# Altium project IV_Array.PrjPcb (part 1 of 2)
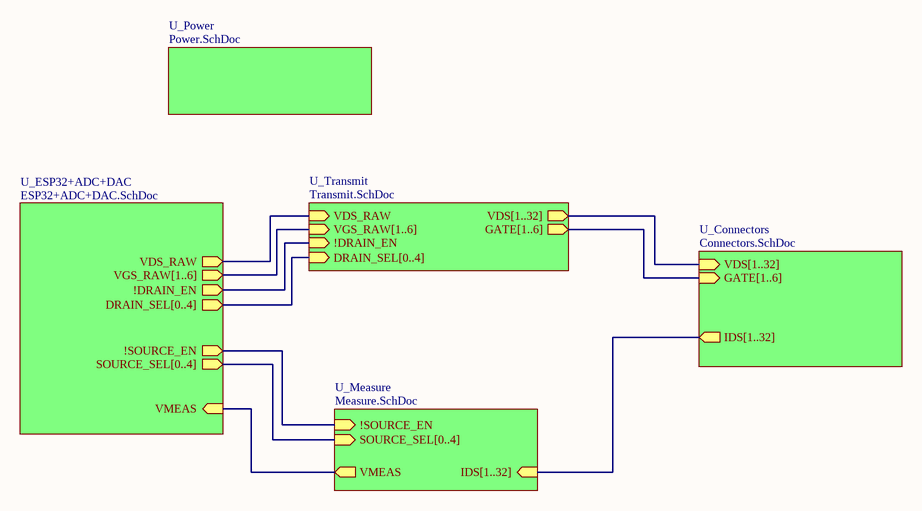
[diagram p0: Top_Level.SchDoc]
CAGE_CODE: ?????; CONTRACT_NUMBER: <CONTRACT NO>; DOC_NO_ASSY_DWG: <ASSY DWG NO>; DOC_NO_BOM: <BOM DOC NO>; DOC_NO_FAB_DWG: <FAB DWG NO>; DOC_NO_SCH_DWG: <SCH DWG NO>; PCB_2_DEC_TOL: +/-.01; PCB_3_DEC_TOL: +/-.010; PCB_ANG_TOL: +/-1/2; PCB_ASSEMBLY_NO: <PCB ASSY NO>; PCB_CHECKER: - -----; PCB_CHECKER_APP_DATE: --/--/----; PCB_DESIGNER: - -----; PCB_DESIGNER_APP_DATE: --/--/----; PCB_DWG_NO: <PCB DWG NO>; PCB_ENGINEER: - -----; PCB_ENGINEER_APP_DATE: --/--/----; PCB_PART_NUMBER: <PCB PN>; PCB_REV: A; SCH_REV: A
5 sheets, 117 parts. Net scope: hierarchical (ports join the sheet entries above them; power ports are global).
Board file: PCB1.PcbDoc
Sheets:
  Top_Level.SchDoc
    U_Connectors = Connectors.SchDoc
    U_ESP32+ADC+DAC = ESP32+ADC+DAC.SchDoc
    U_Transmit = Transmit.SchDoc
    U_Power = Power.SchDoc

## Sheet Top_Level.SchDoc
size 431 x 279 mm; SheetNumber: 1; SheetTotal: 5

### Sub-sheets
U_Connectors = Connectors.SchDoc: GATE[1..6] (in), VDS[1..32] (in), IDS[1..32] (out)
U_ESP32+ADC+DAC = ESP32+ADC+DAC.SchDoc: VDS_RAW (out), VGS_RAW[1..6] (out), !SOURCE_EN (out), !DRAIN_EN (out), DRAIN_SEL[0..4] (out), SOURCE_SEL[0..4] (out), VMEAS (in)
U_Measure = Measure.SchDoc (file not in this document): IDS[1..32] (in), !SOURCE_EN (in), SOURCE_SEL[0..4] (in), VMEAS (out)
U_Power = Power.SchDoc: no entries
U_Transmit = Transmit.SchDoc: VDS_RAW (in), !DRAIN_EN (in), DRAIN_SEL[0..4] (in), VDS[1..32] (out), GATE[1..6] (out), VGS_RAW[1..6] (in)

### Nets
!DRAIN_EN: sheet U_ESP32+ADC+DAC/!DRAIN_EN, sheet U_Transmit/!DRAIN_EN
!SOURCE_EN: sheet U_Measure/!SOURCE_EN, sheet U_ESP32+ADC+DAC/!SOURCE_EN
VDS_RAW: sheet U_ESP32+ADC+DAC/VDS_RAW, sheet U_Transmit/VDS_RAW
VMEAS: sheet U_Measure/VMEAS, sheet U_ESP32+ADC+DAC/VMEAS

### Buses and harness runs
bus sheet U_Connectors/GATE[1..6] = sheet U_Transmit/GATE[1..6]
bus sheet U_Connectors/IDS[1..32] = sheet U_Measure/IDS[1..32]
bus sheet U_Connectors/VDS[1..32] = sheet U_Transmit/VDS[1..32]
bus sheet U_ESP32+ADC+DAC/DRAIN_SEL[0..4] = sheet U_Transmit/DRAIN_SEL[0..4]
bus sheet U_ESP32+ADC+DAC/SOURCE_SEL[0..4] = sheet U_Measure/SOURCE_SEL[0..4]
bus sheet U_ESP32+ADC+DAC/VGS_RAW[1..6] = sheet U_Transmit/VGS_RAW[1..6]

### Notes on the sheet
- DWG. NO.
- REV.
- SHT.
- THIS DOCUMENT AND THE DATA DISCLOSED HEREIN OR HEREWITH IS THE PROPERTY OF ALTIUM LIMITED AND MAY BE FREELY DISTRIBUTED IN WHOLE. NO RIGHTS ARE RESERVED OR EXPRESS OR IMPLIED WARANTEE GIVEN.
- REVISION
- DESCRIPTION
- DATE
- APPROVED
- ENG:
- APPROVALS
- PROJECT
- DSN:
- CHK:
- REFERENCE DOCUMENTS
- PROJECT REVISION:
- TITLE
- DOCUMENT REVISION:
- DESIGN ITEM:
- BOM:
- FAB DWG:
- PCB DWG:
- ASSY DWG:
- SCALE:
- SIZE
- B
- CAGE CODE
- FILE NAME
- DWG NO.
- SHEET
- OF
- REV

## Sheet Connectors.SchDoc
size 431 x 279 mm; SheetNumber: 4; SheetTotal: 6
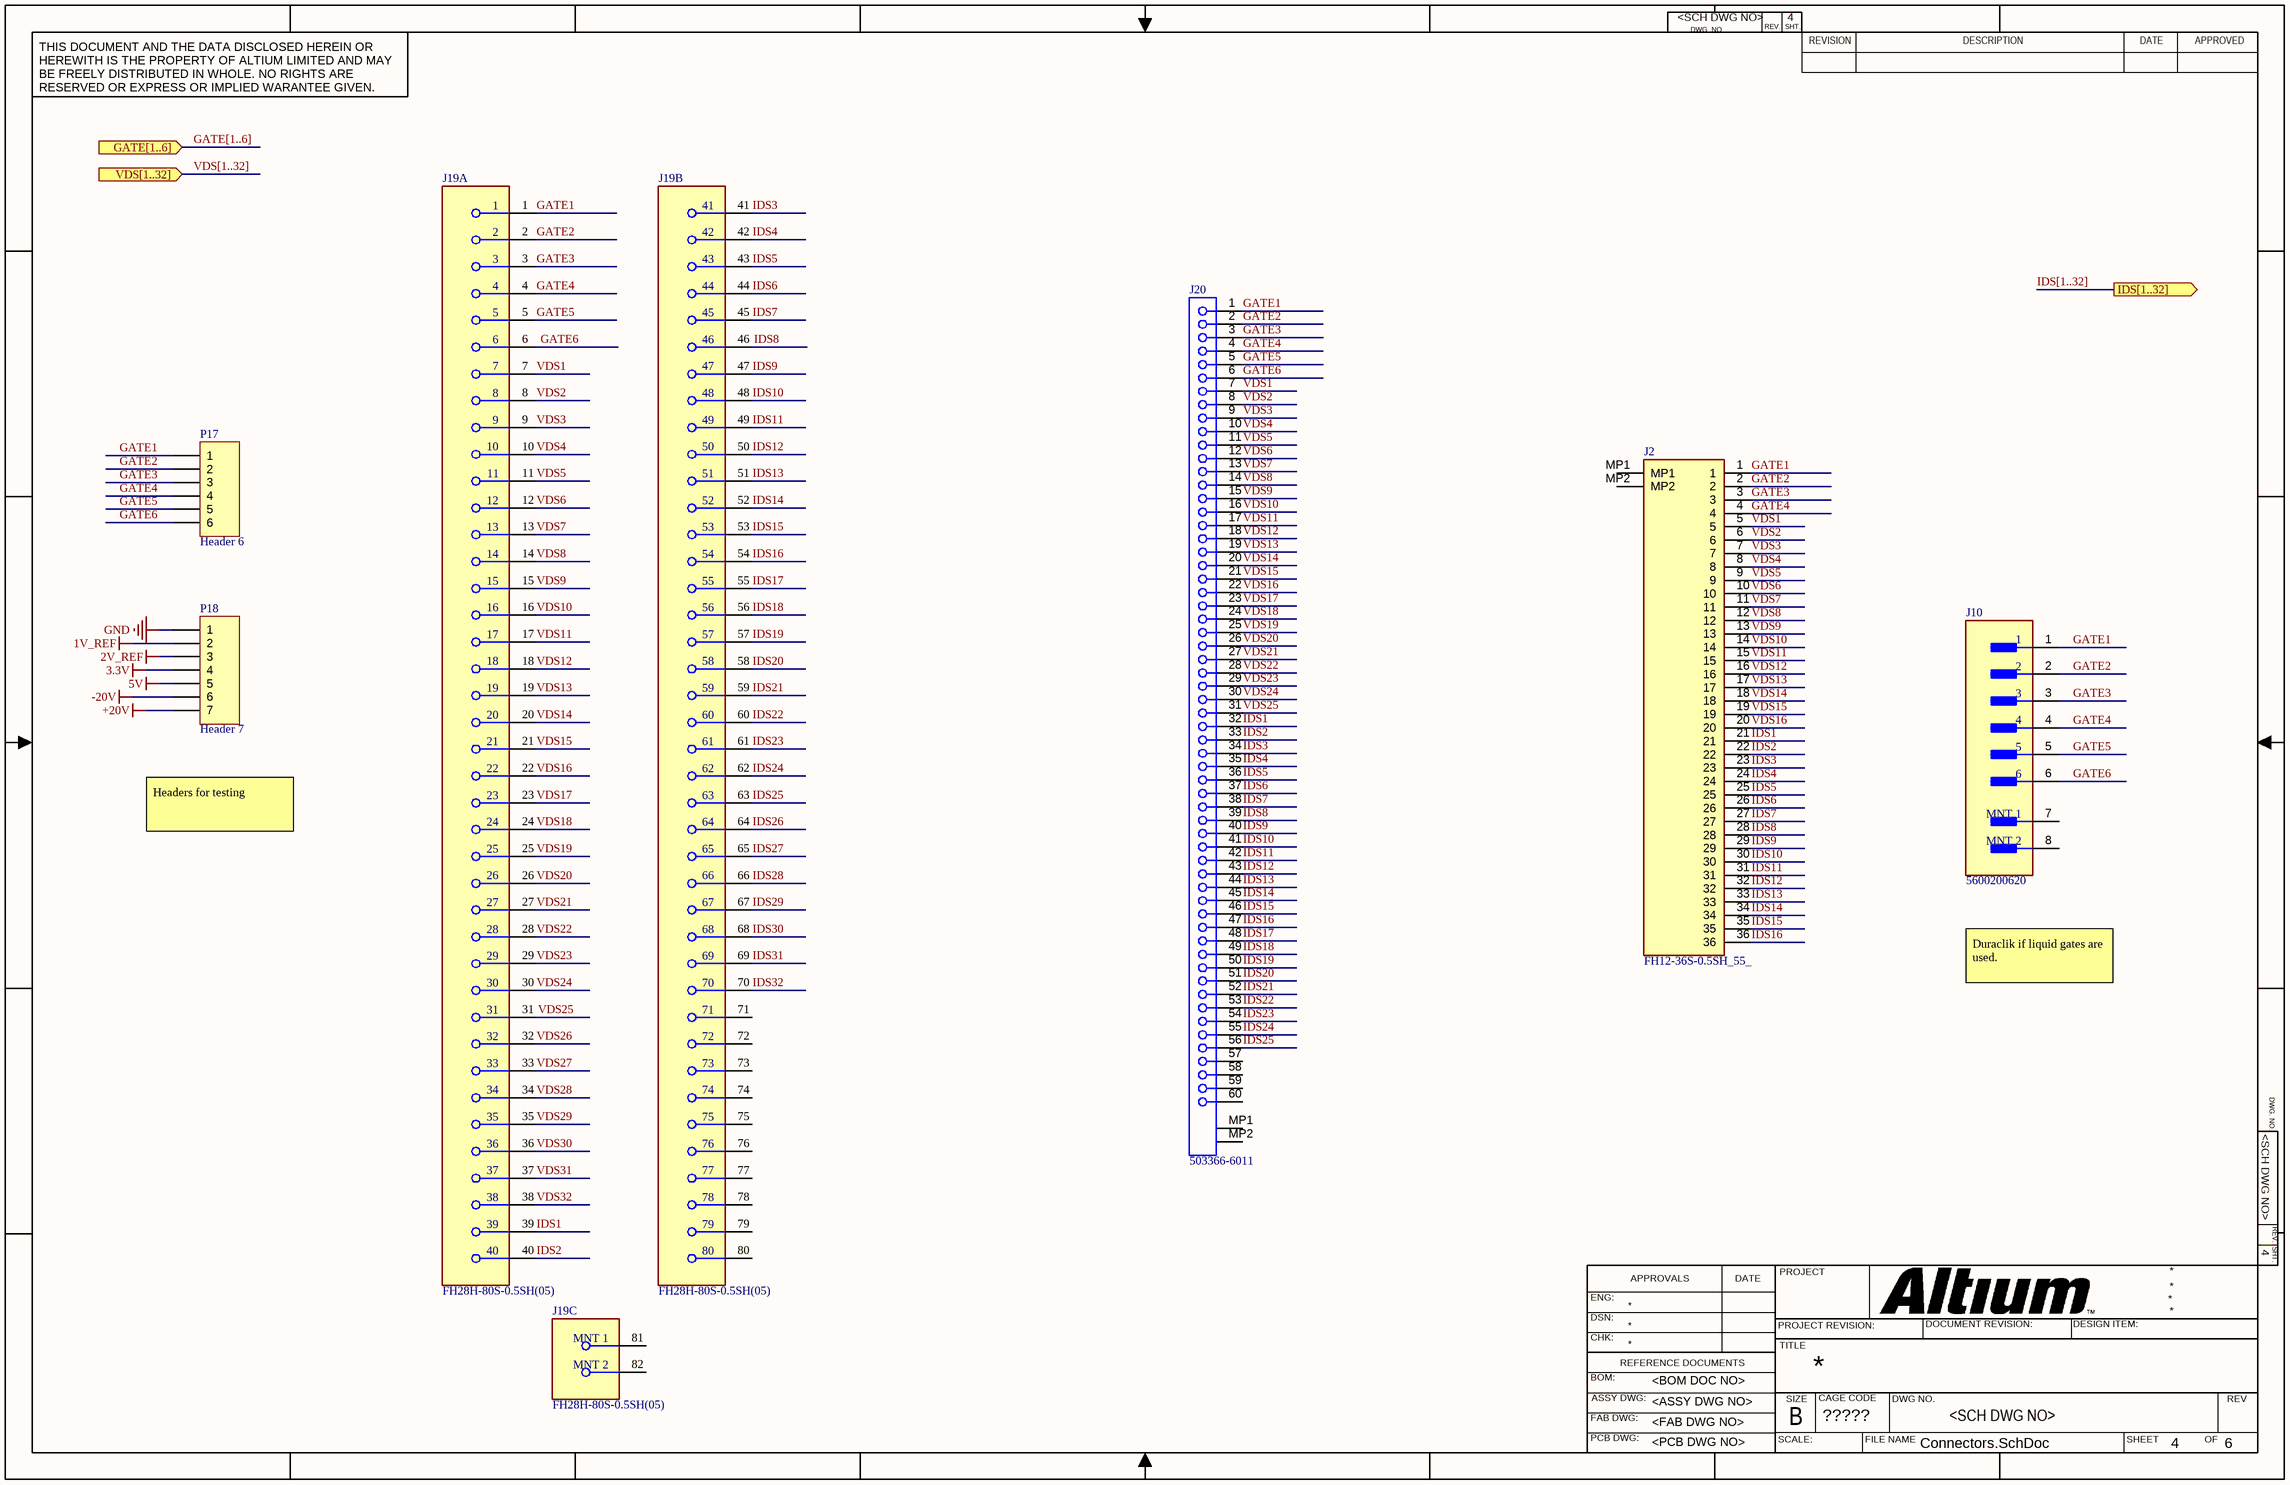
[diagram p1: Connectors.SchDoc]

### Parts
J2  FH12-36S-0.5SH_55_  [FH1236S05SH55]
J10  5600200620  [FP-5600200620-MFG]
J19  FH28H-80S-0.5SH(05)  [FP-FH28H-80S-0_5SH_05-MFG]  (parts A,B,C of 3)
J20  503366-6011  [MOLX-503366-6011]
P17  Header 6  [HDR1X6]
P18  Header 7  [HDR1X7]

### Ports
GATE[1..6] (in), IDS[1..32] (out), VDS[1..32] (in)

### Nets
1V_REF: P18.2
2V_REF: P18.3
3.3V: P18.4
5V: P18.5
+20V: P18.7
-20V: P18.6
GND: P18.1
GATE1: J2.1 J10.1 J19.1 J20.1 P17.1
GATE2: J2.2 J10.2 J19.2 J20.2 P17.2
GATE3: J2.3 J10.3 J19.3 J20.3 P17.3
GATE4: J2.4 J10.4 J19.4 J20.4 P17.4
GATE5: J10.5 J19.5 J20.5 P17.5
GATE6: J10.6 J19.6 J20.6 P17.6
IDS1: J2.21 J19.39 J20.32
IDS2: J2.22 J19.40 J20.33
IDS3: J2.23 J19.41 J20.34
IDS4: J2.24 J19.42 J20.35
IDS5: J2.25 J19.43 J20.36
IDS6: J2.26 J19.44 J20.37
IDS7: J2.27 J19.45 J20.38
IDS8: J2.28 J19.46 J20.39
IDS9: J2.29 J19.47 J20.40
IDS10: J2.30 J19.48 J20.41
IDS11: J2.31 J19.49 J20.42
IDS12: J2.32 J19.50 J20.43
IDS13: J2.33 J19.51 J20.44
IDS14: J2.34 J19.52 J20.45
IDS15: J2.35 J19.53 J20.46
IDS16: J2.36 J19.54 J20.47
IDS17: J19.55 J20.48
IDS18: J19.56 J20.49
IDS19: J19.57 J20.50
IDS20: J19.58 J20.51
IDS21: J19.59 J20.52
IDS22: J19.60 J20.53
IDS23: J19.61 J20.54
IDS24: J19.62 J20.55
IDS25: J19.63 J20.56
IDS26: J19.64
IDS27: J19.65
IDS28: J19.66
IDS29: J19.67
IDS30: J19.68
IDS31: J19.69
IDS32: J19.70
VDS1: J2.5 J19.7 J20.7
VDS2: J2.6 J19.8 J20.8
VDS3: J2.7 J19.9 J20.9
VDS4: J2.8 J19.10 J20.10
VDS5: J2.9 J19.11 J20.11
VDS6: J2.10 J19.12 J20.12
VDS7: J2.11 J19.13 J20.13
VDS8: J2.12 J19.14 J20.14
VDS9: J2.13 J19.15 J20.15
VDS10: J2.14 J19.16 J20.16
VDS11: J2.15 J19.17 J20.17
VDS12: J2.16 J19.18 J20.18
VDS13: J2.17 J19.19 J20.19
VDS14: J2.18 J19.20 J20.20
VDS15: J2.19 J19.21 J20.21
VDS16: J2.20 J19.22 J20.22
VDS17: J19.23 J20.23
VDS18: J19.24 J20.24
VDS19: J19.25 J20.25
VDS20: J19.26 J20.26
VDS21: J19.27 J20.27
VDS22: J19.28 J20.28
VDS23: J19.29 J20.29
VDS24: J19.30 J20.30
VDS25: J19.31 J20.31
VDS26: J19.32
VDS27: J19.33
VDS28: J19.34
VDS29: J19.35
VDS30: J19.36
VDS31: J19.37
VDS32: J19.38

Not connected (* = marked no-connect by the designer): J2 MP1 MP2; J10 7(MNT_1) 8(MNT_2); J19 71 72 73 74 75 76 77 78 79 80 81(MNT_1) 82(MNT_2); J20 57 58 59 60 MP1 MP2

### Buses and harness runs
bus GATE[1..6] = port GATE[1..6]
bus IDS[1..32] = port IDS[1..32]
bus VDS[1..32] = port VDS[1..32]

### Notes on the sheet
- Headers for testing
- Duraclik if liquid gates are used.
- DWG. NO.
- REV.
- SHT.
- THIS DOCUMENT AND THE DATA DISCLOSED HEREIN OR HEREWITH IS THE PROPERTY OF ALTIUM LIMITED AND MAY BE FREELY DISTRIBUTED IN WHOLE. NO RIGHTS ARE RESERVED OR EXPRESS OR IMPLIED WARANTEE GIVEN.
- REVISION
- DESCRIPTION
- DATE
- APPROVED
- ENG:
- APPROVALS
- PROJECT
- DSN:
- CHK:
- REFERENCE DOCUMENTS
- PROJECT REVISION:
- TITLE
- DOCUMENT REVISION:
- DESIGN ITEM:
- BOM:
- FAB DWG:
- PCB DWG:
- ASSY DWG:
- SCALE:
- SIZE
- B
- CAGE CODE
- FILE NAME
- DWG NO.
- SHEET
- OF
- REV

### Library data of the parts
J2 = FH12-36S-0.5SH_55_: Connector; Manufacturer_Name: Hirose; Manufacturer_Part_Number: FH12-36S-0.5SH(55); Datasheet Link: https://www.hirose.com/product/document?clcode=CL0586-0526-4-55&productname=FH12-36S-0.5SH(55)&series=FH12&documenttype=2DDrawing&lang=en&documentid=0000987484; Height: 2.2mm; Mouser Part Number: 798-FH12-36S-0.5SH55; Mouser Price/Stock: https://www.mouser.co.uk/ProductDetail/Hirose-Connector/FH12-36S-05SH55?qs=Ux3WWAnHpjBt9PREjhnzAA%3D%3D; Arrow Part Number: FH12-36S-0.5SH(55); Arrow Price/Stock: https://www.arrow.com/en/products/fh12-36s-0.5sh-55/hirose-electric
J10 = CMP-04776-000066-1: CONN HEADER SMD 6POS 2MM; Manufacturer: Molex; Conn Gender: Male; Conn Orientation: Vertical; Current Rating: 3A; Number Of Contacts: 6; Voltage Rating: 125V; Lead Free: Yes; Device Class L2: Headers and Wire Housings; Footprint Url: https://www.molex.com/pdm_docs/sd/5600200320_sd.pdf; Octopart: https://octopart.com/5600200620-molex-51767481; RoHS: TRUE; Pitch: 2mm; ComponentLink2Description: Datasheet; Device Class L3: unset; Digikey Description: CONN HEADER SMD 6POS 2MM; Automotive: No; Temperature: -40°C to +125°C; Contact Material: Tin,Nickel; ComponentLink2URL: https://www.molex.com/webdocs/datasheets/pdf/en-us/5600200320_PCB_HEADERS.pdf; Package: 5600200620; Height: 8.2mm; Temperature Range High: +125°C; Number Of Rows: 1; Category: Conn; Temperature Range Low: -40°C; Manufacturer Part Number: 5600200620; Device Class L1: Connectors
J19 = CMP-11609-000031-1: CONN FFC BOTTOM 80POS 0.50MM R/A; Number of Positions: 80; Voltage Rating: 50V; Contact Resistance: 50mR; Max Current Rating: 500mA; Gender: Receptacle; Pitch: 0.5mm; Mating Cycles: 20; Actuator Material: Polymer; Insulation Resistance: 500MR; Contact Plating: Gold; Orientation: Right Angle; Contact Material: Bronze; Number of Rows: 1; Max Operating Temperature: 85°C; Number of Contacts: 80; Flammability Rating: UL94 V-0; Lead Pitch: 0.5mm; Length: 44.9mm; Radiation Hardening: No; Packaging: Tape and Reel; RoHS Compliant: Yes; REACH SVHC: No SVHC; Current Rating: 500mA; Housing Color: Grey; Depth: 6.5mm; Min Operating Temperature: -40°C; Series: FH28; Termination: Solder; Package Quantity: 1; Housing Material: Polymer; Mount: Surface Mount; Max Voltage Rating (AC): 50V
J20 = CMP-1241-00108-1: 0.5 mm Pitch Easy-On(TM) FPC Connector, 2.0 mm Mated Height, Right Angle, SMT, Bottom Contact, 60 Circuits, -20 to 85 degC, ELV and RoHS Compliant, Tape and Reel; Manufacturer: Molex; Material - Plating Termination: Tin; Mated Height: 2.00mm; Pitch - Termination Interface: 0.50mm; Material - Metal: Phosphor Bronze; Polarized to PCB: No; Circuits (maximum): 60; Material - Plating Mating: Gold over Nickel; PCB Retention: Yes; Voltage (Max): 50V DC; Durability (mating cycles max): 20; Current (Max per Contact): 0.5A; Entry Angle: Vertical; ComponentLink3Description: Package Specification; ComponentLink1Description: Manufacturer URL; PackageDescription: 60-Lead FPC Connector, Pitch 0.5 mm; Number of Rows: 1; PackageVersion: Rev. A, 04/2010; Packing: Tape and Reel; PartNumber: 503366-6011; ComponentLink2URL: http://www.molex.com/webdocs/datasheets/pdf/en-us/5033666011_FFC_FPC_CONNECTORS.pdf; Circuits (Loaded): 60; Contact Position: Bottom; ComponentLink1URL: http://www.molex.com/molex/index.jsp; Mounting Technology: Surface Mount; ComponentLink2Description: Datasheet; ComponentLink3URL: http://www.molex.com/pdm_docs/sd/5033666011_sd.pdf; Pitch - Mating Interface: 0.50mm; PCB Locator: No; PackageReference: 503366-6011; Stackable: No; Orientation: Right Angle; RoHS: TRUE
P17 = Header 6: Header, 6-Pin; LatestRevisionDate: 17-Jul-2002; LatestRevisionNote: Re-released for DXP Platform.; Publisher: Altium Limited
P18 = Header 7: Header, 7-Pin; LatestRevisionDate: 17-Jul-2002; LatestRevisionNote: Re-released for DXP Platform.; Publisher: Altium Limited

## Sheet ESP32+ADC+DAC.SchDoc
size 431 x 279 mm; SheetNumber: 2; SheetTotal: 6; ENG_APP_DATE: --/--/--; DSN_APP_DATE: --/--/--; CHK_APP_DATE: --/--/--
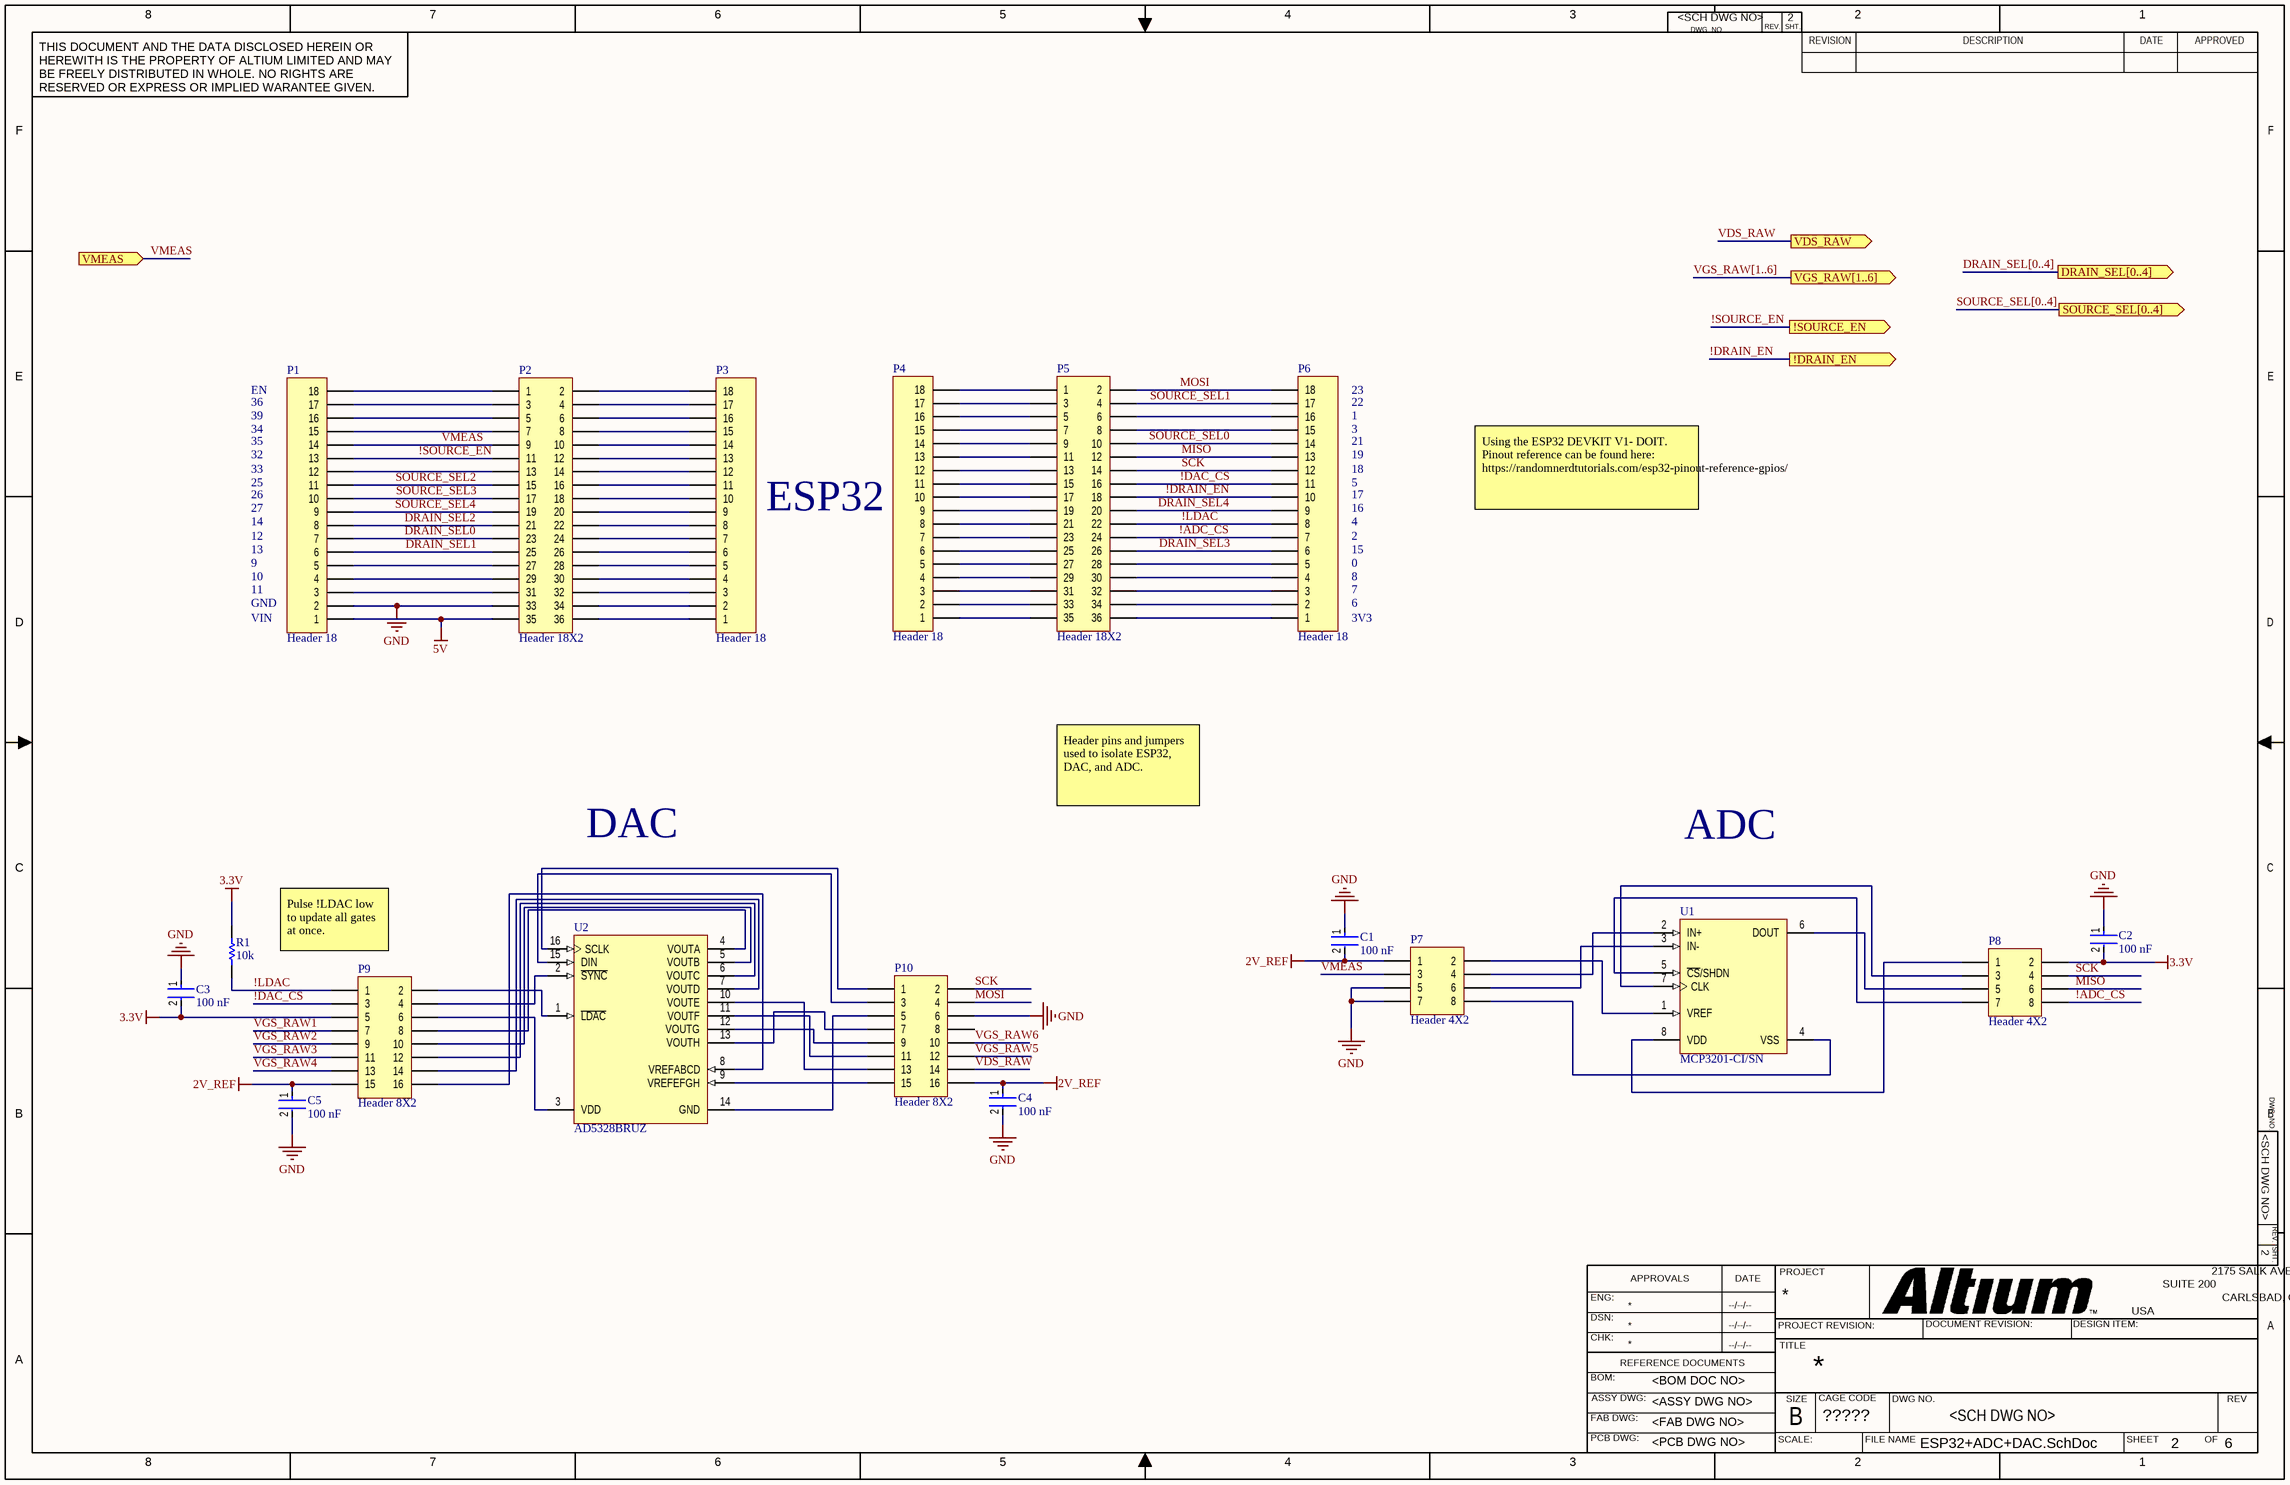
[diagram p2: ESP32+ADC+DAC.SchDoc]

### Parts
C1  100 nF  [FP-C0805C-DN-MFG]
C2  100 nF  [FP-C0805C-DN-MFG]
C3  100 nF  [FP-C0805C-DN-MFG]
C4  100 nF  [FP-C0805C-DN-MFG]
C5  100 nF  [FP-C0805C-DN-MFG]
P1  Header 18  [HDR1X18]
P2  Header 18X2  [HDR2X18]
P3  Header 18  [HDR1X18]
P4  Header 18  [HDR1X18]
P5  Header 18X2  [HDR2X18]
P6  Header 18  [HDR1X18]
P7  Header 4X2  [HDR2X4]
P8  Header 4X2  [HDR2X4]
P9  Header 8X2  [HDR2X8]
P10  Header 8X2  [HDR2X8]
R1  10k  [RESC2013X60X35NL10T20]
U1  MCP3201-CI/SN  [SOIC-SN8_L]
U2  AD5328BRUZ  [RU-16_L]

### Ports
!DRAIN_EN (out), !SOURCE_EN (out), DRAIN_SEL[0..4] (out), SOURCE_SEL[0..4] (out), VDS_RAW (out), VGS_RAW[1..6] (out), VMEAS (in)

### Nets
2V_REF: C1.2 C4.1 C5.1 P7.1 P9.15 P10.16
3.3V: C2.2 C3.2 P8.2 P9.5 R1.2
5V: P1.1 P2.35
GND: C1.1 C2.1 C3.1 C4.2 C5.2 P1.2 P2.33 P7.5 P7.7 P10.6
!ADC_CS: P5.24 P6.7 P8.8
!DAC_CS: P5.16 P6.11 P9.3
!DRAIN_EN: P5.18 P6.10 ; port !DRAIN_EN
!LDAC: P5.22 P6.8 P9.1 R1.1
!SOURCE_EN: P1.13 P2.11 ; port !SOURCE_EN
DRAIN_SEL0: P1.7 P2.23
DRAIN_SEL1: P1.6 P2.25
DRAIN_SEL2: P1.8 P2.21
DRAIN_SEL3: P5.26 P6.6
DRAIN_SEL4: P5.20 P6.9
MISO: P5.12 P6.13 P8.6
MOSI: P5.2 P6.18 P10.4
SCK: P5.14 P6.12 P8.4 P10.2
SOURCE_SEL0: P5.10 P6.14
SOURCE_SEL1: P5.4 P6.17
SOURCE_SEL2: P1.11 P2.15
SOURCE_SEL3: P1.10 P2.17
SOURCE_SEL4: P1.9 P2.19
VDS_RAW: P10.14 ; port VDS_RAW
VGS_RAW1: P9.7
VGS_RAW2: P9.9
VGS_RAW3: P9.11
VGS_RAW4: P9.13
VGS_RAW5: P10.12
VGS_RAW6: P10.10
VMEAS: P1.14 P2.9 P7.3 ; port VMEAS
NetP1_3: P1.3 P2.31
NetP1_4: P1.4 P2.29
NetP1_5: P1.5 P2.27
NetP1_12: P1.12 P2.13
NetP1_15: P1.15 P2.7
NetP1_16: P1.16 P2.5
NetP1_17: P1.17 P2.3
NetP1_18: P1.18 P2.1
NetP2_2: P2.2 P3.18
NetP2_4: P2.4 P3.17
NetP2_6: P2.6 P3.16
NetP2_8: P2.8 P3.15
NetP2_10: P2.10 P3.14
NetP2_12: P2.12 P3.13
NetP2_14: P2.14 P3.12
NetP2_16: P2.16 P3.11
NetP2_18: P2.18 P3.10
NetP2_20: P2.20 P3.9
NetP2_22: P2.22 P3.8
NetP2_24: P2.24 P3.7
NetP2_26: P2.26 P3.6
NetP2_28: P2.28 P3.5
NetP2_30: P2.30 P3.4
NetP2_32: P2.32 P3.3
NetP2_34: P2.34 P3.2
NetP2_36: P2.36 P3.1
NetP4_1: P4.1 P5.35
NetP4_2: P4.2 P5.33
NetP4_3: P4.3 P5.31
NetP4_4: P4.4 P5.29
NetP4_5: P4.5 P5.27
NetP4_6: P4.6 P5.25
NetP4_7: P4.7 P5.23
NetP4_8: P4.8 P5.21
NetP4_9: P4.9 P5.19
NetP4_10: P4.10 P5.17
NetP4_11: P4.11 P5.15
NetP4_12: P4.12 P5.13
NetP4_13: P4.13 P5.11
NetP4_14: P4.14 P5.9
NetP4_15: P4.15 P5.7
NetP4_16: P4.16 P5.5
NetP4_17: P4.17 P5.3
NetP4_18: P4.18 P5.1
NetP5_6: P5.6 P6.16
NetP5_8: P5.8 P6.15
NetP5_28: P5.28 P6.5
NetP5_30: P5.30 P6.4
NetP5_32: P5.32 P6.3
NetP5_34: P5.34 P6.2
NetP5_36: P5.36 P6.1
NetP7_2: P7.2 U1.1(VREF)
NetP7_4: P7.4 U1.2(IN+)
NetP7_6: P7.6 U1.3(IN-)
NetP7_8: P7.8 U1.4(VSS)
NetP8_1: P8.1 U1.8(VDD)
NetP8_3: P8.3 U1.7(CLK)
NetP8_5: P8.5 U1.6(DOUT)
NetP8_7: P8.7 U1.5(~{CS}/SHDN)
NetP9_2: P9.2 U2.1(~{LDAC})
NetP9_4: P9.4 U2.2(~{SYNC})
NetP9_6: P9.6 U2.3(VDD)
NetP9_8: P9.8 U2.4(VOUTA)
NetP9_10: P9.10 U2.5(VOUTB)
NetP9_12: P9.12 U2.6(VOUTC)
NetP9_14: P9.14 U2.7(VOUTD)
NetP9_16: P9.16 U2.8(VREFABCD)
NetP10_1: P10.1 U2.16(SCLK)
NetP10_3: P10.3 U2.15(DIN)
NetP10_5: P10.5 U2.14(GND)
NetP10_7: P10.7 U2.13(VOUTH)
NetP10_9: P10.9 U2.12(VOUTG)
NetP10_11: P10.11 U2.11(VOUTF)
NetP10_13: P10.13 U2.10(VOUTE)
NetP10_15: P10.15 U2.9(VREFEFGH)

Not connected (* = marked no-connect by the designer): P10 8

### Buses and harness runs
bus DRAIN_SEL[0..4] = port DRAIN_SEL[0..4]
bus SOURCE_SEL[0..4] = port SOURCE_SEL[0..4]
bus VGS_RAW[1..6] = port VGS_RAW[1..6]

### Notes on the sheet
- EN
- 36
- 39
- 34
- 23
- 22
- 1
- 3
- 35
- 32
- 33
- 25
- 26
- 21
- 19
- 18
- 5
- 17
- 27
- 14
- 12
- 13
- 9
- ESP32
- 16
- 4
- 2
- 15
- 0
- Using the ESP32 DEVKIT V1- DOIT. Pinout reference can be found here: https://randomnerdtutorials.com/esp32-pinout-reference-gpios/
- 10
- 11
- GND
- VIN
- 8
- 7
- 6
- 3V3
- Header pins and jumpers used to isolate ESP32, DAC, and ADC.
- DAC
- ADC
- Pulse !LDAC low to update all gates at once.
- DWG. NO.
- REV.
- SHT.
- THIS DOCUMENT AND THE DATA DISCLOSED HEREIN OR HEREWITH IS THE PROPERTY OF ALTIUM LIMITED AND MAY BE FREELY DISTRIBUTED IN WHOLE. NO RIGHTS ARE RESERVED OR EXPRESS OR IMPLIED WARANTEE GIVEN.
- REVISION
- DESCRIPTION
- DATE
- APPROVED
- F
- E
- D
- C
- B
- ENG:
- APPROVALS
- PROJECT
- SUITE 200
- 2175 SALK AVENUE
- CARLSBAD, CA 92008
- A
- DSN:
- CHK:
- REFERENCE DOCUMENTS
- PROJECT REVISION:
- TITLE
- DOCUMENT REVISION:
- DESIGN ITEM:
- USA
- BOM:
- FAB DWG:
- PCB DWG:
- ASSY DWG:
- SCALE:
- SIZE
- CAGE CODE
- FILE NAME
- DWG NO.
- SHEET
- OF
- REV

### Library data of the parts
C1-C5 = CMP-2007-00279-2: CAP CER 0.1UF 50V X7R 0805; Manufacturer Part Number: C0805C104K5RACTU; Manufacturer: KEMET; Value: 0.10 μF; Tolerance: 0.1; Temperature Coefficient: 30ppm/°C; Material: Ceramic; Device Class L2: Capacitors; Temperature Range Low: -55°C; Voltage Rating: 50 V; Digikey Description: CAP CER 0.1UF 50V X7R 0805; Category: Cap; ComponentLink2Description: Datasheet; Octopart: https://octopart.com/c0805c104k5ractu-kemet-143926; RoHS: TRUE; ComponentLink2URL: https://content.kemet.com/datasheets/KEM_C1003_C0G_SMD.pdf; Temperature Characteristic: X7R; Temperature: -55°C to +125°C; Height: 0.88mm; Temperature Range High: +125°C; Device Class L1: Passive Components; Automotive: No; Lead Free: Yes; Ipc Land Pattern Name: CAPC200125X78; Device Class L3: Ceramic Capacitors; Mouser Description: Cap Ceramic 0.1uF 50V X7R 10% SMD 2.0 x 1.2 mm 125 C Paper T/R; Capacitance: 0.10 μF; Package: C0805C-DN
P1 P3 P4 P6 = Header 18: Header, 18-Pin; LatestRevisionDate: 17-Jul-2002; LatestRevisionNote: Re-released for DXP Platform.; Publisher: Altium Limited
P2 P5 = Header 18X2: Header, 18-Pin, Dual row; LatestRevisionDate: 17-Jul-2002; LatestRevisionNote: Re-released for DXP Platform.; Publisher: Altium Limited
P7 P8 = Header 4X2: Header, 4-Pin, Dual row; LatestRevisionDate: 17-Jul-2002; LatestRevisionNote: Re-released for DXP Platform.; Publisher: Altium Limited
P9 P10 = Header 8X2: Header, 8-Pin, Dual row; LatestRevisionDate: 17-Jul-2002; LatestRevisionNote: Re-released for DXP Platform.; Publisher: Altium Limited
R1 = CMP-1659-00013-4: Chip Resistor, 10 KOhm, +/- 1%, 0.125 W, -55 to 155 degC, 0805 (2012 Metric), RoHS, Tape and Reel; Manufacturer: Yageo; Voltage Rating: 150 V; Mount: Surface Mount; ComponentLink1Description: Manufacturer URL; ComponentLink2URL: http://www.yageo.com/documents/recent/PYu-RC_Group_51_RoHS_L_04.pdf; Pins: 2; Length: 2 mm; Min Operating Temperature: -55 degC; Height: 0.5 mm; Mounting Technology: Surface Mount; RoHSCompliant: true; REACH SVHC: No SVHC; ComponentLink1URL: http://www.yageo.com/; Max Operating Temperature: 155 degC; PackageReference: 0805; DatasheetVersion: Rev. 4, 02/2016; Package Quantity: 5000; Packaging: Tape and Reel; ComponentLink2Description: Datasheet; PackageDescription: 2-Pin Surface Mounted Device, Body 2 x 1.25 mm
U1 = CMP-0188-00469-2: 2.7V 12-Bit A/D Converter with SPI Serial Interface, 8-Pin SOIC 150mil, C Performance Grade, Industrial Temperature; ComponentLink1URL: http://www.microchip.com/; DatasheetVersion: revF, Aug-2011; RevisionNote: URLs added. DatasheetVersion updated.; Code_IPC: SOIC127P600-8; ComponentLink3URL: http://www.microchip.com/stellent/groups/techpub_sg/documents/packagingspec/en012702.pdf; ComponentLink3Description: Package Specification; ComponentLink2URL: http://ww1.microchip.com/downloads/en/DeviceDoc/21290F.pdf; PackageReference: SOIC-SN8; ComponentLink1Description: Manufacturer URL; ComponentLink2Description: Datasheet; PackageVersion: revBB, Aug-2009; Code_JEDEC: MS-012; PackageDescription: 8-Lead Plastic Small Outline (SN) - Narrow, 3.90mm Body [SOIC]
U2 = CMP-0318-02011-2: Octal 12-Bit Voltage Output Digital-to-Analog Converter, 2.5 to 5.5 V, -40 to +125 degC, RU-16, Pb-Free, Tube; Generic Part Number: AD5328; Manufacturer: Analog Devices; Settling Time: 6Âµs; Op Pwr Diss: 5mW; Max V+: 5.5V; Single Supply: Yes; Resolution (Bits): 12; # DAC Outputs: 8; PackageDescription: 16-Lead Thin Shrink Small Outline Package [TSSOP]; ComponentLink3URL: http://www.analog.com/static/imported-files/packages/36244347913743854010197452789RU16.pdf; DatasheetVersion: Rev.F; ComponentLink2Description: Datasheet; Mounting Technology: Surface Mount; ComponentLink4URL: http://www.analog.com/en/digital-to-analog-converters/da-converters/ad5328/products/product.html; RevisionNote: Component URL fixed; PackageVersion: Nov-2002; PackageReference: RU-16; ComponentLink1URL: http://www.analog.com/en/index.html; ComponentLink4Description: Product URL; ComponentLink1Description: Manufacturer URL; Packing: Tube; ComponentLink2URL: http://www.analog.com/static/imported-files/data_sheets/AD5308_5318_5328.pdf; RoHS: Y; ComponentLink3Description: Package Specification; Code_JEDEC: MO-153-AB; PartNumber: AD5328BRUZ

## Sheet Transmit.SchDoc
size 558 x 431 mm; SheetNumber: 5; SheetTotal: 6
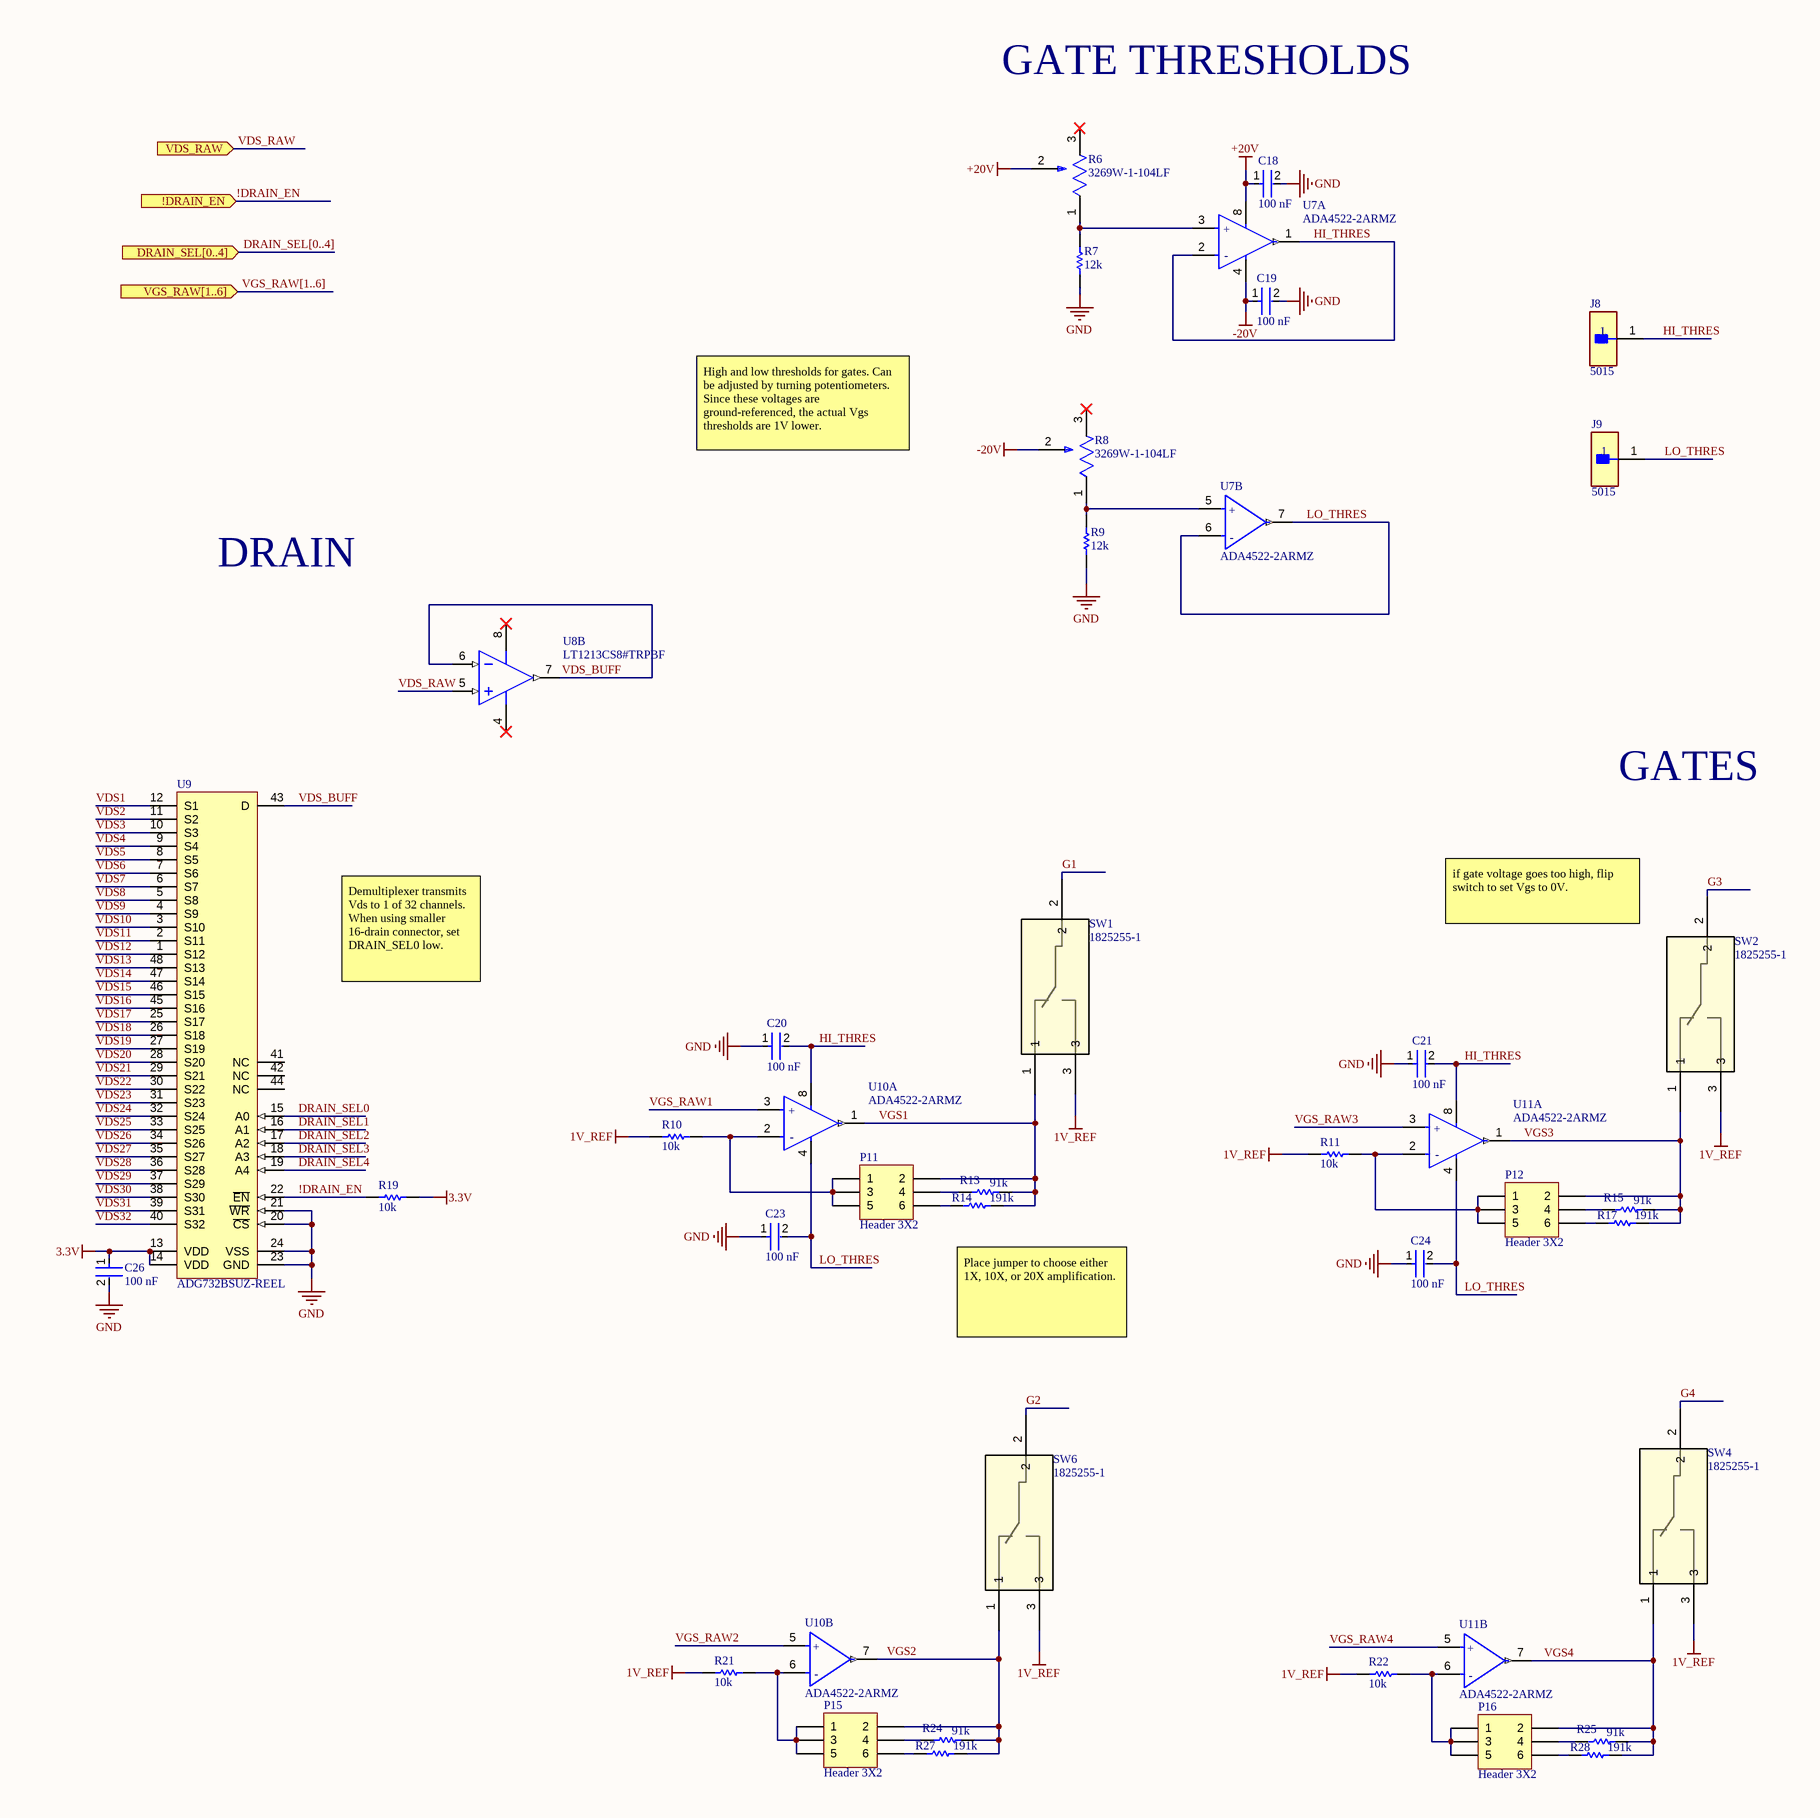
[diagram p3: Transmit.SchDoc, left]
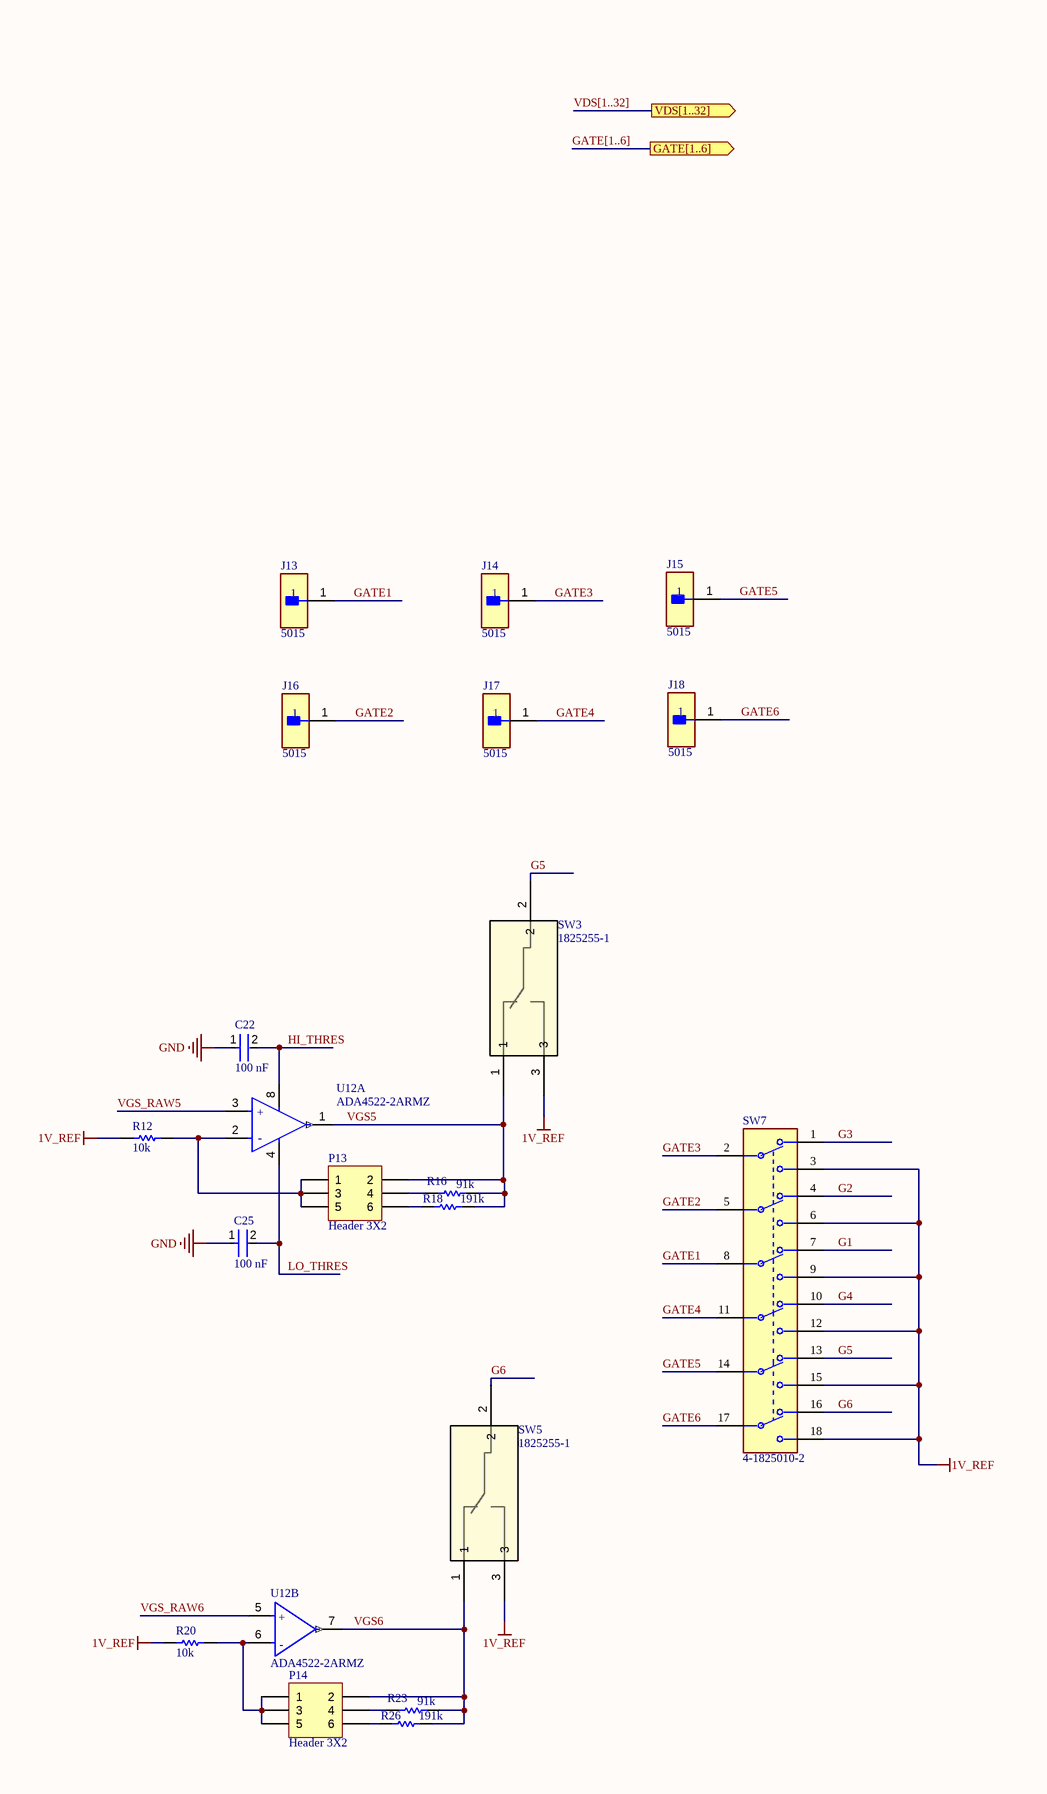
[diagram p4: Transmit.SchDoc, right]

### Parts
C18  100 nF  [FP-C0805C-DN-MFG]
C19  100 nF  [FP-C0805C-DN-MFG]
C20  100 nF  [FP-C0805C-DN-MFG]
C21  100 nF  [FP-C0805C-DN-MFG]
C22  100 nF  [FP-C0805C-DN-MFG]
C23  100 nF  [FP-C0805C-DN-MFG]
C24  100 nF  [FP-C0805C-DN-MFG]
C25  100 nF  [FP-C0805C-DN-MFG]
C26  100 nF  [FP-C0805C-DN-MFG]
J8  5015  [FP-5015-MFG]
J9  5015  [FP-5015-MFG]
J13  5015  [FP-5015-MFG]
J14  5015  [FP-5015-MFG]
J15  5015  [FP-5015-MFG]
J16  5015  [FP-5015-MFG]
J17  5015  [FP-5015-MFG]
J18  5015  [FP-5015-MFG]
P11  Header 3X2  [HDR2X3]
P12  Header 3X2  [HDR2X3]
P13  Header 3X2  [HDR2X3]
P14  Header 3X2  [HDR2X3]
P15  Header 3X2  [HDR2X3]
P16  Header 3X2  [HDR2X3]
R6  3269W-1-104LF  [FP-3269W-MFG]
R7  12k  [RESC2013X60X40ML20T25]
R8  3269W-1-104LF  [FP-3269W-MFG]
R9  12k  [RESC2013X60X40ML20T25]
R10  10k  [RESC2013X60X35NL10T20]
R11  10k  [RESC2013X60X35NL10T20]
R12  10k  [RESC2013X60X35NL10T20]
R13  91k  [RESC2013X60X40LL20T25]
R14  191k  [RESC2013X70X40ML20T20]
R15  91k  [RESC2013X60X40LL20T25]
R16  91k  [RESC2013X60X40LL20T25]
R17  191k  [RESC2013X70X40ML20T20]
R18  191k  [RESC2013X70X40ML20T20]
R19  10k  [RESC2013X60X35NL10T20]
R20  10k  [RESC2013X60X35NL10T20]
R21  10k  [RESC2013X60X35NL10T20]
R22  10k  [RESC2013X60X35NL10T20]
R23  91k  [RESC2013X60X40LL20T25]
R24  91k  [RESC2013X60X40LL20T25]
R25  91k  [RESC2013X60X40LL20T25]
R26  191k  [RESC2013X70X40ML20T20]
R27  191k  [RESC2013X70X40ML20T20]
R28  191k  [RESC2013X70X40ML20T20]
SW1  1825255-1  [SW3_1825255-1_TEC]
SW2  1825255-1  [SW3_1825255-1_TEC]
SW3  1825255-1  [SW3_1825255-1_TEC]
SW4  1825255-1  [SW3_1825255-1_TEC]
SW5  1825255-1  [SW3_1825255-1_TEC]
SW6  1825255-1  [SW3_1825255-1_TEC]
SW7  4-1825010-2  [FP-4-1825010-2-MFG]
U7  ADA4522-2ARMZ  [FP-RM-8-IPC_C]  (parts A,B of 2)
U8  LT1213CS8#TRPBF  [LT-S8-8_N]  (part B of 2)
U9  ADG732BSUZ-REEL  [ADI-SU-48_N]
U10  ADA4522-2ARMZ  [FP-RM-8-IPC_C]  (parts A,B of 2)
U11  ADA4522-2ARMZ  [FP-RM-8-IPC_C]  (parts A,B of 2)
U12  ADA4522-2ARMZ  [FP-RM-8-IPC_C]  (parts A,B of 2)

### Ports
!DRAIN_EN (in), DRAIN_SEL[0..4] (in), GATE[1..6] (out), VDS[1..32] (out), VDS_RAW (in), VGS_RAW[1..6] (in)

### Nets
1V_REF: R10.2 R11.2 R12.2 R20.2 R21.2 R22.2 SW1.3 SW2.3 SW3.3 SW4.3 SW5.3 SW6.3 SW7.3 SW7.6 SW7.9 SW7.12 SW7.15 SW7.18
3.3V: C26.1 R19.1 U9.13(VDD) U9.14(VDD)
+20V: C18.1 R6.2(WIPER) U7.8(V+)
-20V: C19.1 R8.2(WIPER) U7.4(V-)
GND: C18.2 C19.2 C20.1 C21.1 C22.1 C23.1 C24.1 C25.1 C26.2 R7.1 R9.1 U9.20(~{CS}) U9.21(~{WR}) U9.23(GND) U9.24(VSS)
!DRAIN_EN: R19.2 U9.22(~{EN}) ; port !DRAIN_EN
DRAIN_SEL0: U9.15(A0)
DRAIN_SEL1: U9.16(A1)
DRAIN_SEL2: U9.17(A2)
DRAIN_SEL3: U9.18(A3)
DRAIN_SEL4: U9.19(A4)
G1: SW1.2 SW7.7
G2: SW6.2 SW7.4
G3: SW2.2 SW7.1
G4: SW4.2 SW7.10
G5: SW3.2 SW7.13
G6: SW5.2 SW7.16
GATE1: J13.1 SW7.8
GATE2: J16.1 SW7.5
GATE3: J14.1 SW7.2
GATE4: J17.1 SW7.11
GATE5: J15.1 SW7.14
GATE6: J18.1 SW7.17
HI_THRES: C20.2 C21.2 C22.2 J8.1 U7.1(OUT_A) U7.2(-IN_A) U10.8(V+) U11.8(V+) U12.8(V+)
LO_THRES: C23.2 C24.2 C25.2 J9.1 U7.6(-IN_B) U7.7(OUT_B) U10.4(V-) U11.4(V-) U12.4(V-)
VDS1: U9.12(S1)
VDS2: U9.11(S2)
VDS3: U9.10(S3)
VDS4: U9.9(S4)
VDS5: U9.8(S5)
VDS6: U9.7(S6)
VDS7: U9.6(S7)
VDS8: U9.5(S8)
VDS9: U9.4(S9)
VDS10: U9.3(S10)
VDS11: U9.2(S11)
VDS12: U9.1(S12)
VDS13: U9.48(S13)
VDS14: U9.47(S14)
VDS15: U9.46(S15)
VDS16: U9.45(S16)
VDS17: U9.25(S17)
VDS18: U9.26(S18)
VDS19: U9.27(S19)
VDS20: U9.28(S20)
VDS21: U9.29(S21)
VDS22: U9.30(S22)
VDS23: U9.31(S23)
VDS24: U9.32(S24)
VDS25: U9.33(S25)
VDS26: U9.34(S26)
VDS27: U9.35(S27)
VDS28: U9.36(S28)
VDS29: U9.37(S29)
VDS30: U9.38(S30)
VDS31: U9.39(S31)
VDS32: U9.40(S32)
VDS_BUFF: U8.6(-IN_B) U8.7(OUT_B) U9.43(D)
VDS_RAW: U8.5(+IN_B) ; port VDS_RAW
VGS1: P11.2 R13.2 R14.2 SW1.1 U10.1(OUT_A)
VGS2: P15.2 R24.2 R27.2 SW6.1 U10.7(OUT_B)
VGS3: P12.2 R15.2 R17.2 SW2.1 U11.1(OUT_A)
VGS4: P16.2 R25.2 R28.2 SW4.1 U11.7(OUT_B)
VGS5: P13.2 R16.2 R18.2 SW3.1 U12.1(OUT_A)
VGS6: P14.2 R23.2 R26.2 SW5.1 U12.7(OUT_B)
VGS_RAW1: U10.3(+IN_A)
VGS_RAW2: U10.5(+IN_B)
VGS_RAW3: U11.3(+IN_A)
VGS_RAW4: U11.5(+IN_B)
VGS_RAW5: U12.3(+IN_A)
VGS_RAW6: U12.5(+IN_B)
NetP11_1: P11.1 P11.3 P11.5 R10.1 U10.2(-IN_A)
NetP11_4: P11.4 R13.1
NetP11_6: P11.6 R14.1
NetP12_1: P12.1 P12.3 P12.5 R11.1 U11.2(-IN_A)
NetP12_4: P12.4 R15.1
NetP12_6: P12.6 R17.1
NetP13_1: P13.1 P13.3 P13.5 R12.1 U12.2(-IN_A)
NetP13_4: P13.4 R16.1
NetP13_6: P13.6 R18.1
NetP14_1: P14.1 P14.3 P14.5 R20.1 U12.6(-IN_B)
NetP14_4: P14.4 R23.1
NetP14_6: P14.6 R26.1
NetP15_1: P15.1 P15.3 P15.5 R21.1 U10.6(-IN_B)
NetP15_4: P15.4 R24.1
NetP15_6: P15.6 R27.1
NetP16_1: P16.1 P16.3 P16.5 R22.1 U11.6(-IN_B)
NetP16_4: P16.4 R25.1
NetP16_6: P16.6 R28.1
NetR6_1: R6.1(CCW) R7.2 U7.3(+IN_A)
NetR8_1: R8.1(CCW) R9.2 U7.5(+IN_B)

Not connected (* = marked no-connect by the designer): R6 3(CW)*; R8 3(CW)*; U8 4(V-)* 8(V+)*; U9 41(NC) 42(NC) 44(NC)

### Buses and harness runs
bus DRAIN_SEL[0..4] = port DRAIN_SEL[0..4]
bus GATE[1..6] = port GATE[1..6]
bus VDS[1..32] = port VDS[1..32]
bus VGS_RAW[1..6] = port VGS_RAW[1..6]

### Notes on the sheet
- GATE THRESHOLDS
- High and low thresholds for gates. Can be adjusted by turning potentiometers. Since these voltages are ground-referenced, the actual Vgs thresholds are 1V lower.
- DRAIN
- GATES
- (near SW2) if gate voltage goes too high, flip switch to set Vgs to 0V.
- Demultiplexer transmits Vds to 1 of 32 channels. When using smaller 16-drain connector, set DRAIN_SEL0 low.
- Place jumper to choose either 1X, 10X, or 20X amplification.
- DWG. NO.
- REV.
- SHT.
- REVISION
- DESCRIPTION
- DATE
- APPROVED
- THIS DOCUMENT AND THE DATA DISCLOSED HEREIN OR HEREWITH IS THE PROPERTY OF ALTIUM LIMITED AND MAY BE FREELY DISTRIBUTED IN WHOLE. NO RIGHTS ARE RESERVED OR EXPRESS OR IMPLIED WARANTEE GIVEN.
- ENG:
- DSN:
- APPROVALS
- PROJECT
- DOCUMENT REVISION:
- DESIGN ITEM:
- CHK:
- BOM:
- REFERENCE DOCUMENTS
- PROJECT REVISION:
- TITLE
- FAB DWG:
- PCB DWG:
- ASSY DWG:
- SCALE:
- SIZE
- C
- CAGE CODE
- FILE NAME
- DWG NO.
- SHEET
- OF
- REV
- (in symbol CMP-09116-000003-2, part A) +; -
- (in symbol CMP-09116-000003-2, part B) +; -

### Library data of the parts
C18-C26 = CMP-2007-00279-2: as C1 on sheet ESP32+ADC+DAC; Device Class L2: Capacitors; Temperature Range Low: -55°C; Voltage Rating: 50 V; Digikey Description: CAP CER 0.1UF 50V X7R 0805; Category: Cap; ComponentLink2Description: Datasheet; Octopart: https://octopart.com/c0805c104k5ractu-kemet-143926; RoHS: TRUE; ComponentLink2URL: https://content.kemet.com/datasheets/KEM_C1003_C0G_SMD.pdf; Temperature Characteristic: X7R; Temperature: -55°C to +125°C; Height: 0.88mm; Temperature Range High: +125°C; Device Class L1: Passive Components; Automotive: No; Lead Free: Yes; Ipc Land Pattern Name: CAPC200125X78; Device Class L3: Ceramic Capacitors; Mouser Description: Cap Ceramic 0.1uF 50V X7R 10% SMD 2.0 x 1.2 mm 125 C Paper T/R; Capacitance: 0.10 μF; Package: C0805C-DN
J8 J9 J13-J18 = CMP-2000-05183-2: PC TEST POINT MINIATURE; Manufacturer: keystone; Number Of Contacts: 1; Conn Orientation: Straight; Category: Conn; Manufacturer Part Number: 5015; Digikey Description: PC TEST POINT MINIATURE; Automotive: No; Lead Free: Yes; Octopart: https://octopart.com/5015-keystone-3822; ComponentLink2URL: http://www.keyelco.com/product-pdf.cfm?p=1353; Package: 5015; RoHS: TRUE; Device Class L3: unset; Device Class L2: unset; Contact Material: Silver; Device Class L1: Connectors; Height: 1.65mm; ComponentLink2Description: Datasheet
P11-P16 = Header 3X2: Header, 3-Pin, Dual row; LatestRevisionDate: 17-Jul-2002; LatestRevisionNote: Re-released for DXP Platform.; Publisher: Altium Limited
R6 R8 = CMP-07234-000021-1: TRIMMER 100K OHM 0.25W SMD; Manufacturer: Bourns; Temperature Coefficient: 100ppm/°C; Tolerance: 10%; Resistance: 100kΩ; Value: 100kΩ; Composition: Cermet; Height: 8.96mm; ComponentLink2URL: https://www.bourns.com/docs/Product-Datasheets/3269.pdf; Mouser Description: Res Cermet Trimmer 100K Ohm 10% 1/4W 12(Elec)Turn 1.78mm (6.35 X 6.36 X 8.46mm) Gull Wing SMD Tube; ComponentLink2Description: Datasheet; Temperature Range High: +150°C; Temperature: -65°C to +150°C; Series: 3269; Device Class L1: Passive Components; RoHS: TRUE; Octopart: https://octopart.com/3269w-1-104lf-bourns-114162; Temperature Range Low: -65°C; Device Class L2: Resistors; Digikey Description: TRIMMER 100K OHM 0.25W SMD; Manufacturer Part Number: 3269W-1-104LF; Power Rating: 0.25W; Device Class L3: Variable Resistors and Potentiometers; Lead Free: Yes; Package: 3269W; Category: Res; Automotive: No
R7 R9 = CMP-2001-00590-1: Part Number: ERA6AEB123V; Manufacturer: Panasonic
R10-R12 R19-R22 = CMP-1659-00013-4: as R1 on sheet ESP32+ADC+DAC; Mount: Surface Mount; ComponentLink1Description: Manufacturer URL; ComponentLink2URL: http://www.yageo.com/documents/recent/PYu-RC_Group_51_RoHS_L_04.pdf; Pins: 2; Length: 2 mm; Min Operating Temperature: -55 degC; Height: 0.5 mm; Mounting Technology: Surface Mount; RoHSCompliant: true; REACH SVHC: No SVHC; ComponentLink1URL: http://www.yageo.com/; Max Operating Temperature: 155 degC; PackageReference: 0805; DatasheetVersion: Rev. 4, 02/2016; Package Quantity: 5000; Packaging: Tape and Reel; ComponentLink2Description: Datasheet; PackageDescription: 2-Pin Surface Mounted Device, Body 2 x 1.25 mm
R13 R15 R16 R23-R25 = CMP-2001-00677-1: Part Number: ERA6AEB913V; Manufacturer: Panasonic
R14 R17 R18 R26-R28 = CMP-2001-00021-1: Manufacturer: Panasonic; Part Number: ERJ-6ENF1913V
SW1-SW6 = 1825255-1: No Description Available; Mfr_Name: TE Connectivity; Copyright: Copyright (C) 2022 Ultra Librarian. All rights reserved.; Manufacturer_Part_Number: 1825255-1; RefDes: RefDes; Type: DEV
SW7 = CMP-03405-000018-1: SWITCH SLIDE 6PDT 300MA 115V; PCB Mount Retention: Without; Switching Capacity: 400mW; Insulation Resistance: 1GR; Actuator Type: Standard; Switch Function: On-On; Number of Positions: 6; Actuator Length: 2.79mm; Actuator Material: Nylon; Contact Current Rating: 300mA; Packaging: Rail/Tube; Max Voltage Rating (AC): 115V; Min Operating Temperature: -40°C; Contact Plating: Silver; Max Current Rating: 300mA; Orientation: Vertical; Depth: 9.4mm; Max Operating Temperature: 80°C; Termination: Gull Wing; Radiation Hardening: No; Flammability Rating: UL94 V-0; Type: Switch; Mount: Surface Mount; Case/Package: SMD/SMT; Series: ASE; Throw Configuration: 6PDT; Length: 1inch; Housing Material: Polychlorinated; Contact Material: Copper Alloy; Width: 7.37mm; RoHS Compliant: Yes; Package Quantity: 252
U7 U10-U12 = CMP-09116-000003-2: IC OPAMP ZERO-DRIFT 2 CIRC 8MSOP; Max Dual Supply Voltage: 27.5V; Power Supply Rejection Ratio (PSRR): 150dB; Operating Supply Current: 830uA; Max Supply Voltage: 55V; Min Dual Supply Voltage: 2.25V; Input Bias Current: 50pA; Gain Bandwidth Product: 2.7MHz; Voltage Gain: 137dB; Common Mode Rejection Ratio: 140dB; Slew Rate: 1.7V/µs; Input Offset Voltage (Vos): 1.5uV; Output Current per Channel: 32mA; Min Supply Voltage: 4.5V; Packaging: Rail/Tube; Max Operating Temperature: 125°C; Min Operating Temperature: -40°C; Mount: Surface Mount; Number of Pins: 8; Case/Package: MSOP; Lead Free: Contains Lead
U8 = CMP-0359-03127-2: Dual Channel, Precision, Fast Operational Amplifier, 28 MHz Typical GBW, 8.5 V/us Typical SR, 2.5 to 36 V, 8-Pin SOIC (S8-8), Commercial, Pb-Free, Reel; Linear Technology Part Number: LT1213; Manufacturer: Linear Technology; Vos (mV) Typical: 0.075; Vs Max (V): 36; SR (V/us) Typical: 8.5; GBW (MHz) Typical: 28; Vs Min (V): 2.5; Is (mA) Typical: 2.7; Channels (#): 2; ComponentLink2Description: Datasheet; ComponentLink1Description: Manufacturer URL; RoHS: Pb-Free; DatasheetVersion: Rev. A; RevisionNote: URLs updated; Packing: Reel; ComponentLink3Description: Package Specification; ComponentLink2URL: http://cds.linear.com/docs/en/datasheet/12134fa.pdf; ComponentLink3URL: http://cds.linear.com/docs/en/packaging/05081610_G_SO8.pdf; Mounting Technology: Surface Mount; Type: VFB; PartNumber: LT1213CS8#TRPBF; PackageDescription: 8-Pin Plastic Small Outline, Body 4.9 x 3.9 mm, Pitch 1.27 mm; ComponentLink1URL: http://www.linear.com/; PackageVersion: Rev G; PackageReference: LT-S8-8
U9 = CMP-0798-00236-1: 1.8 to 5.5 V / +/-2.5 V, 4 Ohm, 32-Channel Analog Multiplexer, -40 to 85 degC, 48-pin QFP (SU-48), Reel; Manufacturer: Analog Devices; Ron (ohms): 4; Max Analog Signal Range: Vss to Vdd; Bandwidth (Hz): 18M; Supply V Guar Performance: Dual_(+/-2.5V), Single_(+3V), Single_(+5V); t transition (s): 23n; PackageReference: SU-48; ComponentLink3URL: http://www.analog.com/static/imported-files/packages/470644706845302410119987SU48_7x7.pdf; PartNumber: ADG732BSUZ-REEL; ComponentLink1URL: http://www.analog.com/en/index.html; Mounting Technology: Surface Mount; ComponentLink2Description: Datasheet; Packing: Reel; ComponentLink1Description: Manufacturer URL; DatasheetVersion: Rev. 0; ComponentLink2URL: http://www.analog.com/static/imported-files/data_sheets/ADG726_732.pdf; PackageDescription: 48-Pin Thin Plastic Quad Flat Package, Body 7 x 7 mm, Pitch 0.5 mm; Code_JEDEC: MS-026ABC; ComponentLink3Description: Package Specification

## Sheet Power.SchDoc
size A; SheetNumber: 6; SheetTotal: 6; SPICEModelCacheUQLPFCSE: <root> / <DocumentId>UQLPFCSE</DocumentId> / <CacheFrame Number="0"> / <Model Name="emk107bj104_aht" Kind="CKT"> / <Text>* EMK107BJ104_AHT     SPICE MODEL  ( General Type ) / *-------------------------------------------------------------------------------------------------------- / * Model Generated by TAIYO YUDEN Corporation (http://www.ty-top.com) / * Version 1.0 / * TAIYO YUDEN Control No. 170508_121019 / * Copyright(c) 2012 TAIYO YUDEN CO.,LTD. All Rights Reserved. / *-------------------------------------------------------------------------------------------------------- / * / * Products Name : Multilayer Ceramic Capacitors / * / * Characteristics : / *     Capacitance : 0.1 uF , Rated Voltage : 16V , TCC : X5R / *     Case Size : 1.6 x 0.8 / 0.063 x 0.031 [mm/inch] , Thickness : 0.8 / 0.031 [mm/inch] / *     (Conditions: Temperature = 25 degC , DC Bias Current/Voltage = 0A / 0V) / * / * Frequency Range : 40Hz - 3GHz / * / * External Node Assignments : / * / *  1  o---| |---o  2 / * / *-------------------------------------------------------------------------------------------------------- / .SubCkt EMK107BJ104_AHT 1 2 / **************************** / C0 1 110 0.090459u / Cm 1 101 4956.4p / C1 101 102 0.016591u / Rc1 101 102 43.844k / C2 102 103 7741.8p / Rc2 102 103 3.295k / C3 103 110 1316.9p / Rc3 103 110 73.25 / C2m 1 301 5652.5p / C21 301 302 0.070707u / Rc21 301 302 100.18k / C22 302 303 0.057154u / Rc22 302 303 103.86k / C23 303 304 0.037105u / Rc23 303 304 126.48k / C24 304 305 0.025687u / Rc24 304 305 5.6768k / C25 305 306 0.031692u / Rc25 305 306 4.3781k / C26 306 307 0.019496u / Rc26 306 307 431.82 / C27 307 308 9278.5p / Rc27 307 308 250.63 / C28 308 309 2021.1p / Rc28 308 309 351.66 / C29 309 110 132.48p / Rc29 309 110 53.803 / Rp0 1 110 5G / L0 110 120 0.28722n / Lm 120 130 0.14567n / L1 120 121 0.19688n / RL1 121 130 0.63688 / L2 120 122 0.4263n / RL2 122 130 1.7594 / L3 120 123 0.56496n / RL3 123 130 2.073 / CR 120 124 0.016445u / LR 124 125 0.19521n / RR 125 130 0.14106 / CL 130 140 1.6993p / LL 130 140 0.2325n / RL 130 140 47.364 / Rs 140 2 14.947m / **************************** / .ends EMK107BJ104_AHT</Text> / </Model> / <Model Name="tmk316bj105_d-t" Kind="CKT"> / <Text>* TMK316BJ105_D-T     SPICE MODEL  ( General Type ) / *-------------------------------------------------------------------------------------------------------- / * Model Generated by TAIYO YUDEN Corporation (http://www.ty-top.com) / * Version 1.0 / * TAIYO YUDEN Control No. 170508_100817 / * Copyright(c) 2012 TAIYO YUDEN CO.,LTD. All Rights Reserved. / *-------------------------------------------------------------------------------------------------------- / * / * Products Name : Multilayer Ceramic Capacitors / * / * Characteristics : / *     Capacitance : 1 uF , Rated Voltage : 25V , TCC : B / X5R / *     Case Size : 3.2 x 1.6 / 0.126 x 0.063 [mm/inch] , Thickness : 0.85 / 0.033 [mm/inch] / *     (Conditions: Temperature = 25 degC , DC Bias Current/Voltage = 0A / 0V) / * / * Frequency Range : 40Hz - 3GHz / * / * External Node Assignments : / * / *  1  o---| |---o  2 / * / *-------------------------------------------------------------------------------------------------------- / .SubCkt TMK316BJ105_D-T 1 2 / **************************** / C0 1 110 0.89653u / Cm 1 101 0.058713u / C1 101 102 0.1587u / Rc1 101 102 7.1768k / C2 102 103 0.049506u / Rc2 102 103 763.46 / C3 103 110 1507.5p / Rc3 103 110 12.633 / C2m 1 301 0.070806u / C21 301 302 0.3533u / Rc21 301 302 18.812k / C22 302 303 0.24304u / Rc22 302 303 25.852k / C23 303 304 0.44253u / Rc23 303 304 11.087k / C24 304 305 0.11927u / Rc24 304 305 1.9403k / C25 305 306 0.17455u / Rc25 305 306 1.1901k / C26 306 307 0.058236u / Rc26 306 307 156.55 / C27 307 308 4143.3p / Rc27 307 308 85.064 / C28 308 309 4159.9p / Rc28 308 309 75.965 / C29 309 110 294.26p / Rc29 309 110 34.212 / Rp0 1 110 500Meg / L0 110 120 0.44086n / Lm 120 130 0.34458n / RL1 120 130 141.25 / L2 120 122 0.91807n / RL2 122 130 0.61722 / L3 120 123 1.2468n / RL3 123 130 0.41744 / CR 120 124 9.0669u / LR 124 125 0.41723n / RR 125 130 0.25689 / CL 130 140 8.6808p / LL 130 140 0.28687n / RL 130 140 10.893 / Rs 140 2 11.509m / **************************** / .ends TMK316BJ105_D-T</Text> / </Model> / </CacheFrame> / </root>
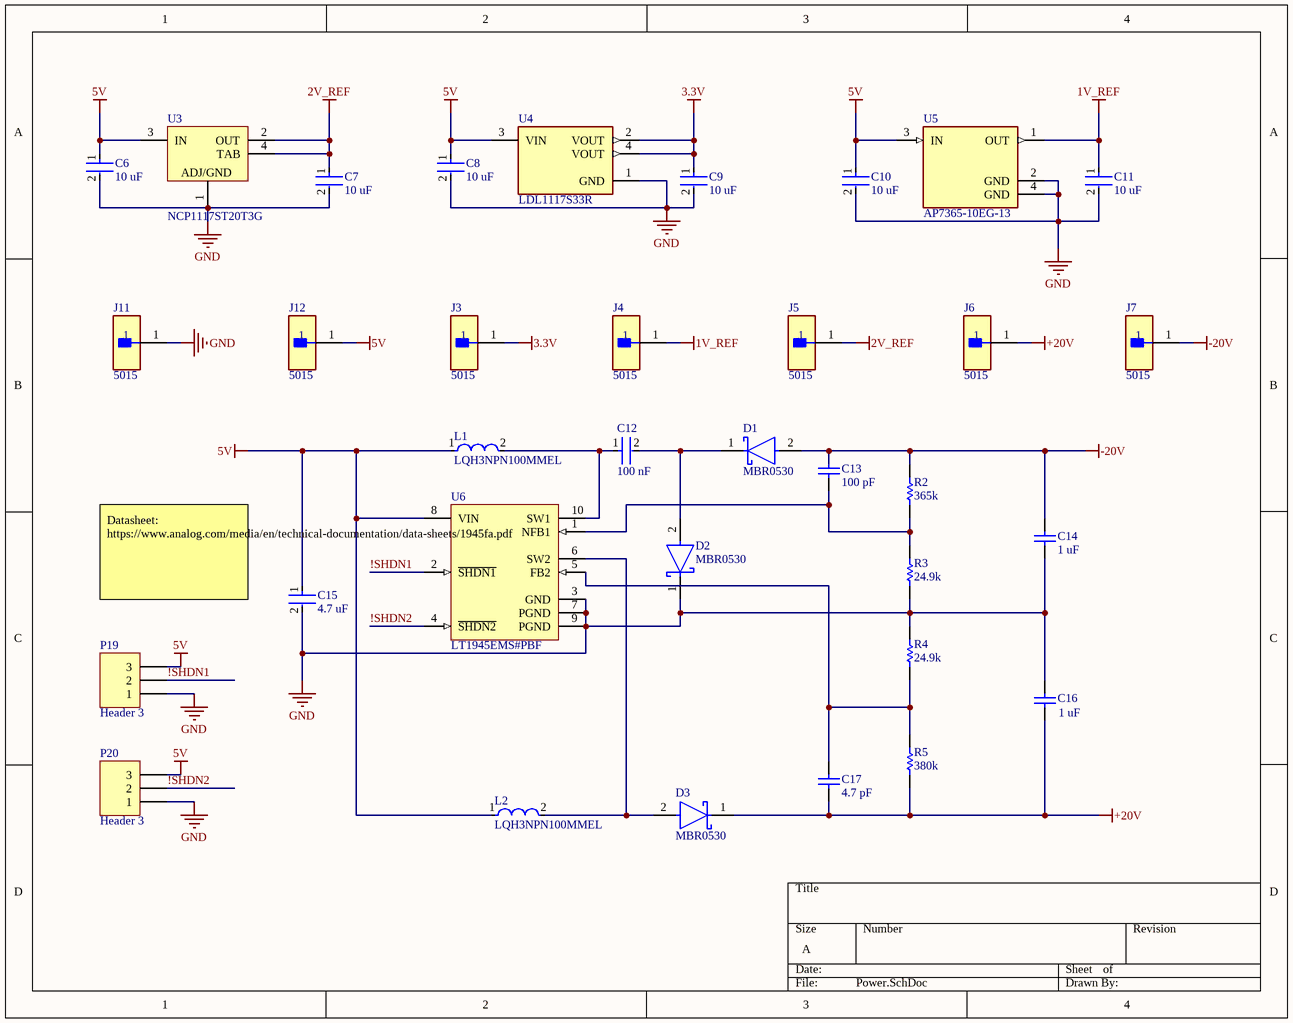
[diagram p5: Power.SchDoc]

### Parts
C6  10 uF  [FP-CL21-IPC_A]
C7  10 uF  [FP-CL21-IPC_A]
C8  10 uF  [FP-CL21-IPC_A]
C9  10 uF  [FP-CL21-IPC_A]
C10  10 uF  [FP-CL21-IPC_A]
C11  10 uF  [FP-CL21-IPC_A]
C12  100 nF  [FP-C0805C-DN-MFG]
C13  100 pF  [CAPC2013X140X50ML20T25]
C14  1 uF  [CAPC3216X110X50LL20T25]
C15  4.7 uF  [FP-C0805C475K3PACTU-MFG]
C16  1 uF  [CAPC3216X110X50LL20T25]
C17  4.7 pF  [CAPC2013X71X50ML20T25]
D1  MBR0530  [FP-425-04-MFG]
D2  MBR0530  [FP-425-04-MFG]
D3  MBR0530  [FP-425-04-MFG]
J3  5015  [FP-5015-MFG]
J4  5015  [FP-5015-MFG]
J5  5015  [FP-5015-MFG]
J6  5015  [FP-5015-MFG]
J7  5015  [FP-5015-MFG]
J11  5015  [FP-5015-MFG]
J12  5015  [FP-5015-MFG]
L1  LQH3NPN100MMEL  [FP-LQH3NPH_ME-MFG]
L2  LQH3NPN100MMEL  [FP-LQH3NPH_ME-MFG]
P19  Header 3  [HDR1X3]
P20  Header 3  [HDR1X3]
R2  365k  [RESC2013X70X40NL20T20]
R3  24.9k  [RESC2013X70X40LL20T20]
R4  24.9k  [RESC2013X70X40LL20T20]
R5  380k  [RESC2013X70X40ML20T20]
U3  NCP1117ST20T3G  [ONSC-SOT-223-4-318H-01_A_V]
U4  LDL1117S33R  [FP-SOT223-0046067-IPC_C]
U5  AP7365-10EG-13  [FP-SOT223-IPC_C]
U6  LT1945EMS#PBF  [LT-MS-10_N]

### Nets
1V_REF: C11.1 J4.1 U5.1(OUT)
2V_REF: C7.1 J5.1 U3.2(OUT) U3.4(TAB)
3.3V: C9.1 J3.1 U4.2(VOUT) U4.4(VOUT)
5V: C6.1 C8.1 C10.1 C15.1 J12.1 L1.1 L2.1 P19.3 P20.3 U3.3(IN) U4.3(VIN) U5.3(IN) U6.8(VIN)
+20V: C16.1 C17.1 D3.1(C) J6.1 R5.1
-20V: C13.1 C14.2 D1.2(A) J7.1 R2.2
GND: C6.2 C7.2 C8.2 C9.2 C10.2 C11.2 C14.1 C15.2 C16.2 D2.1(C) J11.1 P19.1 P20.1 R3.1 R4.2 U3.1(ADJ/GND) U4.1(GND) U5.2(GND) U5.4(GND) U6.3(GND) U6.7(PGND) U6.9(PGND)
!SHDN1: P19.2 U6.2(~{SHDN1})
!SHDN2: P20.2 U6.4(~{SHDN2})
NetC12_1: C12.1 L1.2 U6.10(SW1)
NetC12_2: C12.2 D1.1(C) D2.2(A)
NetC13_2: C13.2 R2.1 R3.2 U6.1(NFB1)
NetC17_2: C17.2 R4.1 R5.2 U6.5(FB2)
NetD3_2: D3.2(A) L2.2 U6.6(SW2)

### Notes on the sheet
- Datasheet: https://www.analog.com/media/en/technical-documentation/data-sheets/1945fa.pdf

### Library data of the parts
C6-C11 = CMP-13271-002975-1: CL21 Series 0805 10uF 25V ±10% Tolerance X5R Multilayer Ceramic Chip Capacitor; Case Code (Imperial): 0805; Length: 2mm; Case/Package: 0805; Packaging: Tape and Reel; Width: 0.049inch; Tolerance: 10%; Mount: Surface Mount; Min Operating Temperature: -55°C; Thickness: 0.057inch; Height: 1.25mm; Dielectric: X5R; Package Quantity: 1; Depth: 1.25mm; Capacitance: 10uF; Voltage Rating: 25V; Case Code (Metric): 2012; Max Operating Temperature: 85°C; Radiation Hardening: No
C12 = CMP-2007-00279-2: as C1 on sheet ESP32+ADC+DAC; Device Class L2: Capacitors; Temperature Range Low: -55°C; Voltage Rating: 50 V; Digikey Description: CAP CER 0.1UF 50V X7R 0805; Category: Cap; ComponentLink2Description: Datasheet; Octopart: https://octopart.com/c0805c104k5ractu-kemet-143926; RoHS: TRUE; ComponentLink2URL: https://content.kemet.com/datasheets/KEM_C1003_C0G_SMD.pdf; Temperature Characteristic: X7R; Temperature: -55°C to +125°C; Height: 0.88mm; Temperature Range High: +125°C; Device Class L1: Passive Components; Automotive: No; Lead Free: Yes; Ipc Land Pattern Name: CAPC200125X78; Device Class L3: Ceramic Capacitors; Mouser Description: Cap Ceramic 0.1uF 50V X7R 10% SMD 2.0 x 1.2 mm 125 C Paper T/R; Capacitance: 0.10 μF; Package: C0805C-DN
C13 = CMP-2007-04713-1: 08055C101KAT2A; Manufacturer: AVX Interconnect / Elco; Part Number: 08055C101KAT2A
C14 C16 = CMP-2000-06011-1: C1206C105K5RACTU; Manufacturer: Kemet; Case Height: 1mm; Dielectric: X7R; Voltage Rating: 50V; Capacitance: 1uF; Temperature Coefficient / Code: +/-15%; Case Length: 3.2mm; Case Width: 1.6mm; Type: SMDMLCCX7R6.3-250VDCCommericalGrade; Tolerance: 10%; Class: Class1; Capacitance - nF: 1000nF; Datasheet URL: http://www.kemet.com/docfinder?Partnumber=C1206C105K5RACTU; Product Category: MultilayerCeramicCapacitorsMLCC-SMD/SMT; Termination Style: SMD/SMT; Dimensions: 1.6mmWx3.2mmLx1mmH; Voltage Rating DC: 50V; Datasheet Version: 02/2016; Packaging: Reel; Brand: Kemet; RoHS: Details; Minimum Operating Temperature: -55C; Operating Temperature Range: -55Cto+125C; Package Reference: 1206; Manufacturer URL: http://www.kemet.com/; Product: GeneralTypeMLCCs; Package Description: 2-Pin Surface Mount Device, Body 3.2 x 1.6 mm; Mounting Technology: SurfaceMount; Case Code - mm: 3216; Maximum Operating Temperature: +125C; Series: C1206C; Factory Pack Quantity: 2500; Package / Case: 1206(3216metric); Case Code - in: 1206
C15 = CMP-2007-01010-2: CAP CER 4.7UF 25V X5R 0805; Tolerance: 10%; Dielectric Material: Ceramic; Dissipation Factor: 5%; Length: 2mm; Number of Pins: 2; Voltage Rating (DC): 25V; Depth: 1.25mm; Min Operating Temperature: -55°C; Capacitance: 4.7uF; Series: C0805C; Lead Free: Lead Free; Dielectric: X5R; REACH SVHC: No SVHC; Termination: SMD/SMT; Mount: PCB; Package Quantity: 2500; Contact Plating: Tin; Case Code (Imperial): 0805; Max Operating Temperature: 85°C; Width: 1.2mm; Voltage: 25V; Case/Package: 0805; Packaging: Tape and Reel; Height: 1.25mm; RoHS Compliant: Yes; Construction: Flat; Case Code (Metric): 2012; Radiation Hardening: No
C17 = CMP-1036-00549-2: 08055A4R7CAT2A; Manufacturer: AVX Interconnect / Elco; Part Number: 08055A4R7CAT2A
D1-D3 = CMP-2000-05113-2: DIODE SCHOTTKY 30V 500MA SOD123; Polarity: Standard; Max Reverse Leakage Current: 130uA; Forward Voltage: 430mV; Element Configuration: Single; Peak Non-Repetitive Surge Current: 5.5A; REACH SVHC: No SVHC; Contact Plating: Tin; Width: 1.6mm; Weight: 0.03g; Max Reverse Voltage (DC): 30V; Mount: Surface Mount; Max Repetitive Reverse Voltage (Vrrm): 30V; Number of Pins: 2; Height: 1.03mm; Current Rating: 500mA; Max Forward Surge Current (Ifsm): 5.5A; Lead Free: Lead Free; Max Surge Current: 5.5A; Peak Reverse Current: 130uA; Min Operating Temperature: -65°C; Radiation Hardening: No; Max Operating Temperature: 150°C; Average Rectified Current: 500mA; Packaging: Tape and Reel; Length: 2.7mm; Forward Current: 500mA; Voltage Rating (DC): 30V; Package Quantity: 1; Output Current: 500mA
J3-J7 J11 J12 = CMP-2000-05183-2: as J8 on sheet Transmit; Category: Conn; Manufacturer Part Number: 5015; Digikey Description: PC TEST POINT MINIATURE; Automotive: No; Lead Free: Yes; Octopart: https://octopart.com/5015-keystone-3822; ComponentLink2URL: http://www.keyelco.com/product-pdf.cfm?p=1353; Package: 5015; RoHS: TRUE; Device Class L3: unset; Device Class L2: unset; Contact Material: Silver; Device Class L1: Connectors; Height: 1.65mm; ComponentLink2Description: Datasheet
L1 L2 = CMP-06042-002074-1: Wire Wound Ferrite Inductor for Power Lines 10μH ±20% 0.228Ω 1280mA 1212; Current Rating: 1.28A; DC Resistance (DCR): 228mR; Inductance: 10uH; Saturation Current: 810mA; Self Resonant Frequency: 20MHz; Shielding: Shielded; Test Frequency: 1MHz; Core Material: Ferrite; Resistor Type: Wirewound; Case/Package: 1212; Min Operating Temperature: -40°C; Packaging: Tape and Reel; Max Operating Temperature: 85°C; Tolerance: 20%; Case Code (Imperial): 1212; Case Code (Metric): 3030; Mount: Surface Mount
P19 P20 = Header 3: Header, 3-Pin; LatestRevisionDate: 17-Jul-2002; LatestRevisionNote: Re-released for DXP Platform.; Publisher: Altium Limited
R2 = CMP-2001-00152-1: Part Number: ERJ-6ENF3653V; Manufacturer: Panasonic
R3 R4 = CMP-2001-00073-1: Part Number: ERJ-6ENF2492V; Manufacturer: Panasonic
R5 = CMP-2001-00160-1: Part Number: ERJ-6ENF3833V; Manufacturer: Panasonic
U3 = CMP-1679-00010-1: Low-Dropout Positive Fixed Voltage Regulator, 1 A, 2.0 V Output Voltage, 0 to 125 degC, 4-Pin SOT-223 (318H-01), Pb-Free, Tape and Reel; Resistance: 220 kohm; Type (Resistor): Thick Film; Voltage Rating: 75 V; Tolerance: 1%; Case\Package: 0603; Power Rating: 100 mW; Width: 0.85 mm; Weight: 7.1E-05 oz; ComponentLink2URL: http://www.onsemi.com/pub_link/Collateral/NCP1117-D.PDF; RoHSCompliant: true; Height: 0.45 mm; PackageDescription: 4-Pin Small Outline Transistor, Body 6.5 x 3.5 mm, Pitch 2.3 mm; ComponentLink1Description: Manufacturer URL; ComponentLink1URL: http://www.onsemi.com/; PackageReference: SOT-223-4-318H-01_A; Max Operating Temperature: 155 degC; Packaging: Tape and Reel; REACH SVHC: Unknown; Length: 1.55 mm; Package Quantity: 5000; Radiation Hardening: No; Min Operating Temperature: -55 degC; DatasheetVersion: Rev. 27, 09/2014; Mount: Surface Mount; Case Code (Imperial): 0603; Case Code (Metric): 1608; ComponentLink2Description: Datasheet
U4 = CMP-12153-000006-1: IC REG LINEAR 3.3V 1.2A SOT223; Manufacturer: STMicroelectronics; Output Type: Fixed; Min Supply Voltage: 2.6V; Number Of Outputs: 1; Dropout Voltage: 350mV; Output Current: 2A; Nominal Supply Current: 250uA; Standoff Height: 0.02mm; Max Supply Voltage: 18V; Max Junction Temp: +125°C; Accuracy Percentage: 2%; Automotive: No; Device Class L2: Power Management ICs; Height: 1.9mm; Octopart: https://octopart.com/ldl1117s33r-stmicroelectronics-81876163; Output Voltage: 3.3V; Package: SOT223-0046067; Lead Free: Yes; Temperature Range Low: -40°C; Category: IC; Device Class L1: Integrated Circuits (ICs); Ipc Land Pattern Name: SOT230P700X190-4; Mouser Description: LDL1117 Series 1.2 A 3.3 V High PSRR LDO Linear Voltage Regulator-SOT-223; ComponentLink2Description: Datasheet; ComponentLink2URL: https://www.st.com/resource/en/datasheet/ldl1117.pdf; Device Class L3: Voltage Regulators - Linear; Manufacturer Part Number: LDL1117S33R; Temperature Range High: +125°C; Digikey Description: IC REG LINEAR 3.3V 1.2A SOT223; Temperature: -40°C to +125°C; RoHS: TRUE
U5 = CMP-12756-000040-1: IC REG LIN 1V 600MA SOT223-3; Output Voltage: 3.3V; Max Input Voltage: 6V; Min Current Limit: 800mA; Polarity: Positive; Accuracy: 2%; Number of Outputs: 1; Quiescent Current: 80uA; Output Type: Fixed; Dropout Voltage: 300mV; Min Input Voltage: 2V; Package Quantity: 2500; Number of Pins: 4; Packaging: Tape and Reel; Min Operating Temperature: -40°C; Mount: Surface Mount; Output Current: 600mA; Max Output Current: 600mA; Max Operating Temperature: 85°C; Case/Package: SOT-223-3; Radiation Hardening: No; REACH SVHC: No SVHC; Number of Regulators: 1; Weight: 0.000282oz
U6 = CMP-0478-00153-1: Dual Micropower DC/DC Converter with Positive and Negative Outputs, 1.2 to 15 V Vin, 10-pin SOP (MS-10), -40 to 85 degC, Pb-Free; Manufacturer: Linear Technology; Number of Outputs: 2; Vin Max(V): 15; Vin Min(V): 1.2; ComponentLink3Description: Package Specification; RoHS: TRUE; ComponentLink1Description: Manufacturer URL; ComponentLink2URL: http://cds.linear.com/docs/en/datasheet/1945fa.pdf; PartNumber: LT1945EMS#PBF; Mounting Technology: Surface Mount; PackageVersion: Rev. E, 06/2010; ComponentLink1URL: http://www.linear.com/; DatasheetVersion: Rev. A; PackageReference: MS-10; ComponentLink2Description: Datasheet; PackageDescription: 10-Pin Plastic MSOP, Body 3 x 3 mm, Pitch 0.5 mm; ComponentLink3URL: http://cds.linear.com/docs/en/packaging/05081661_F_MS.pdf